# EAGLE design CNCPlotter (EAGLE 6.3)
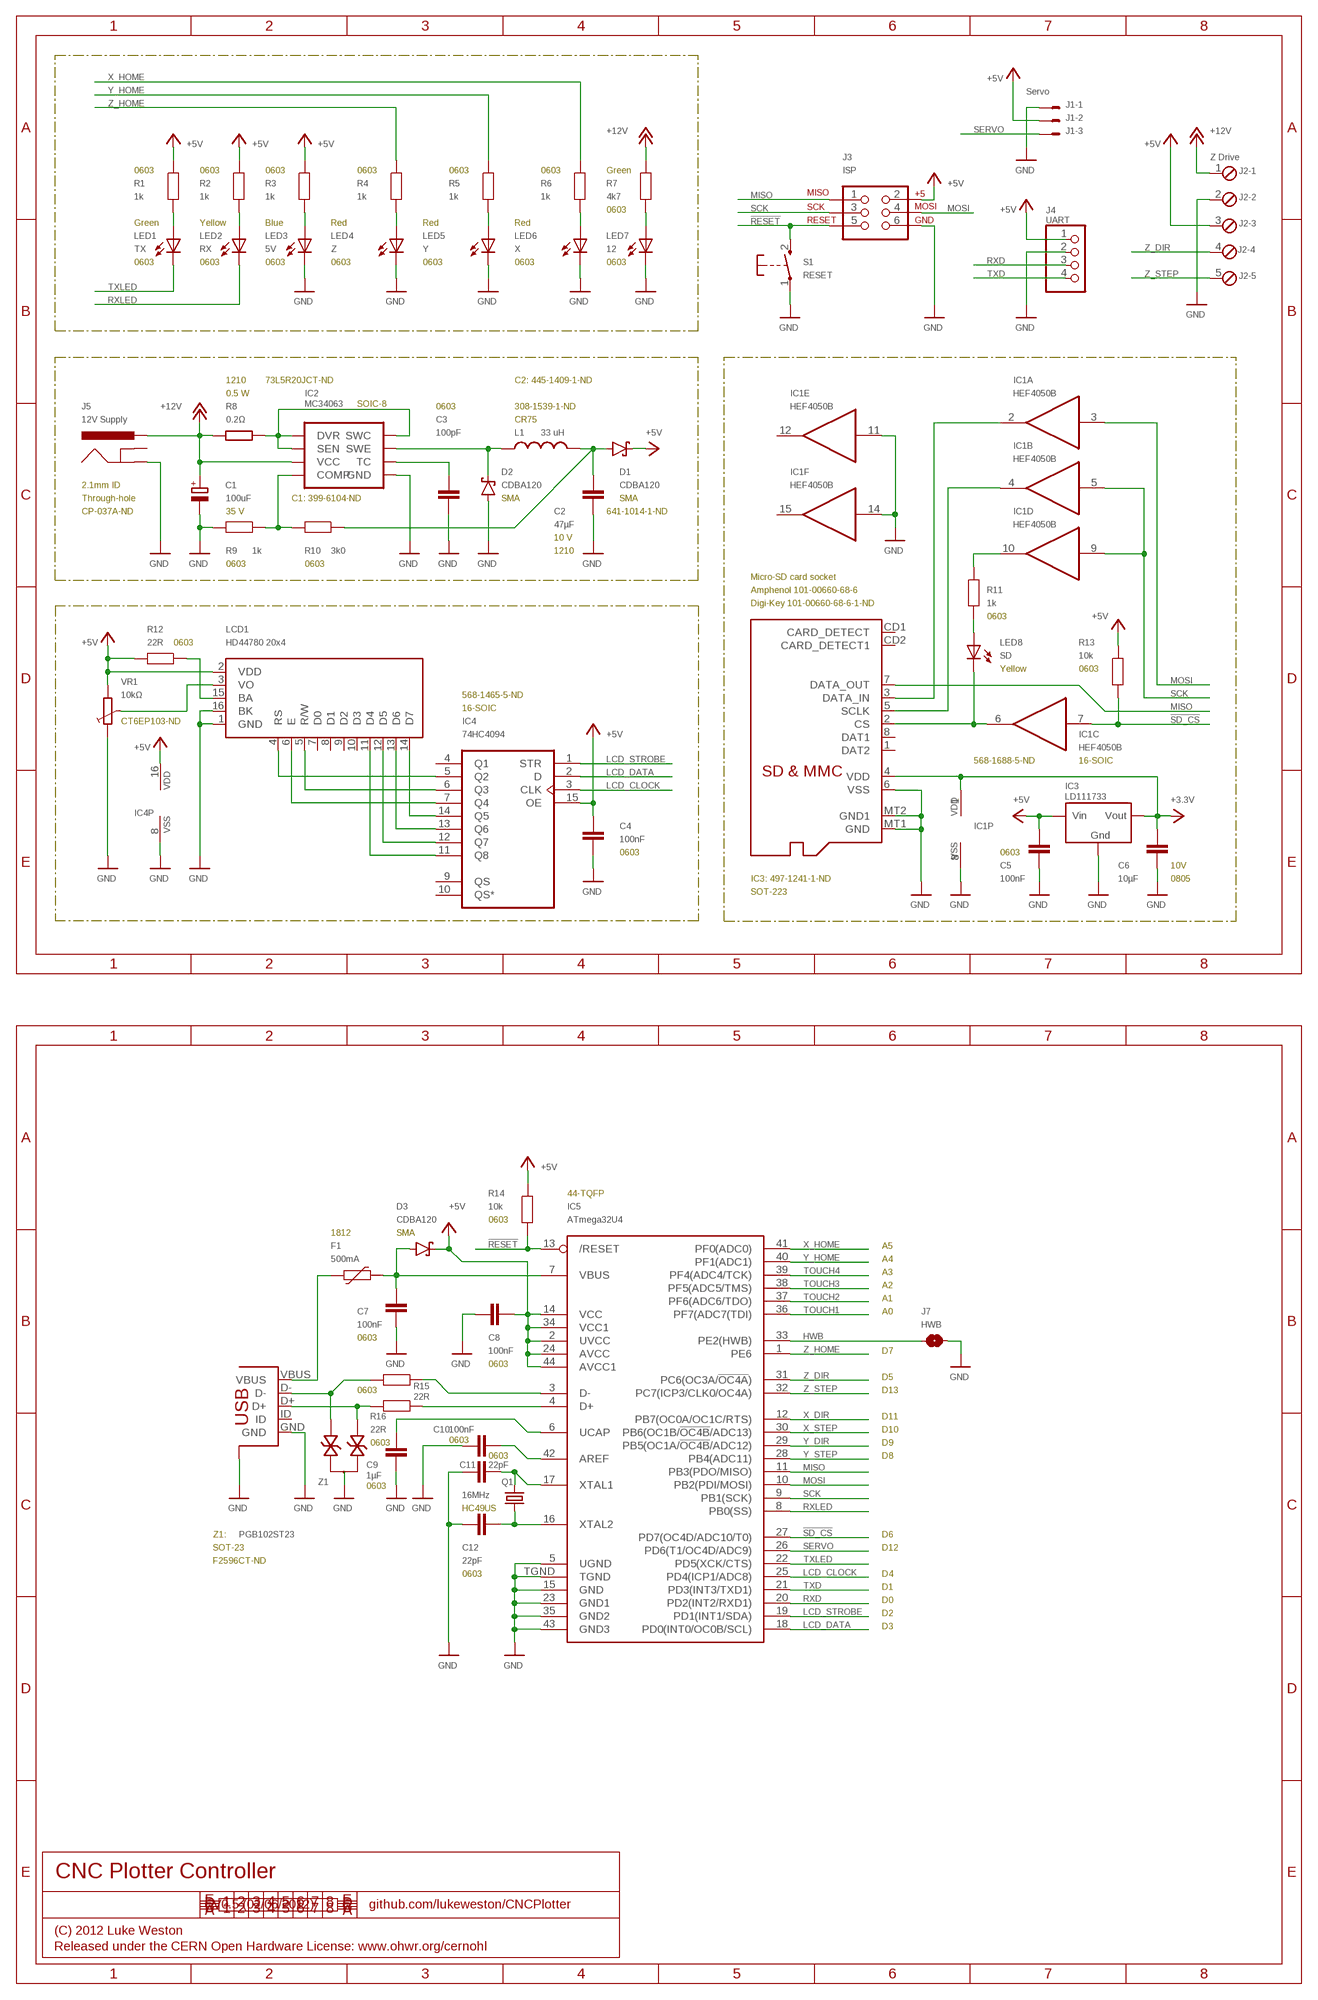
[diagram p0: schematic, sheet 1, part 1 of 2]
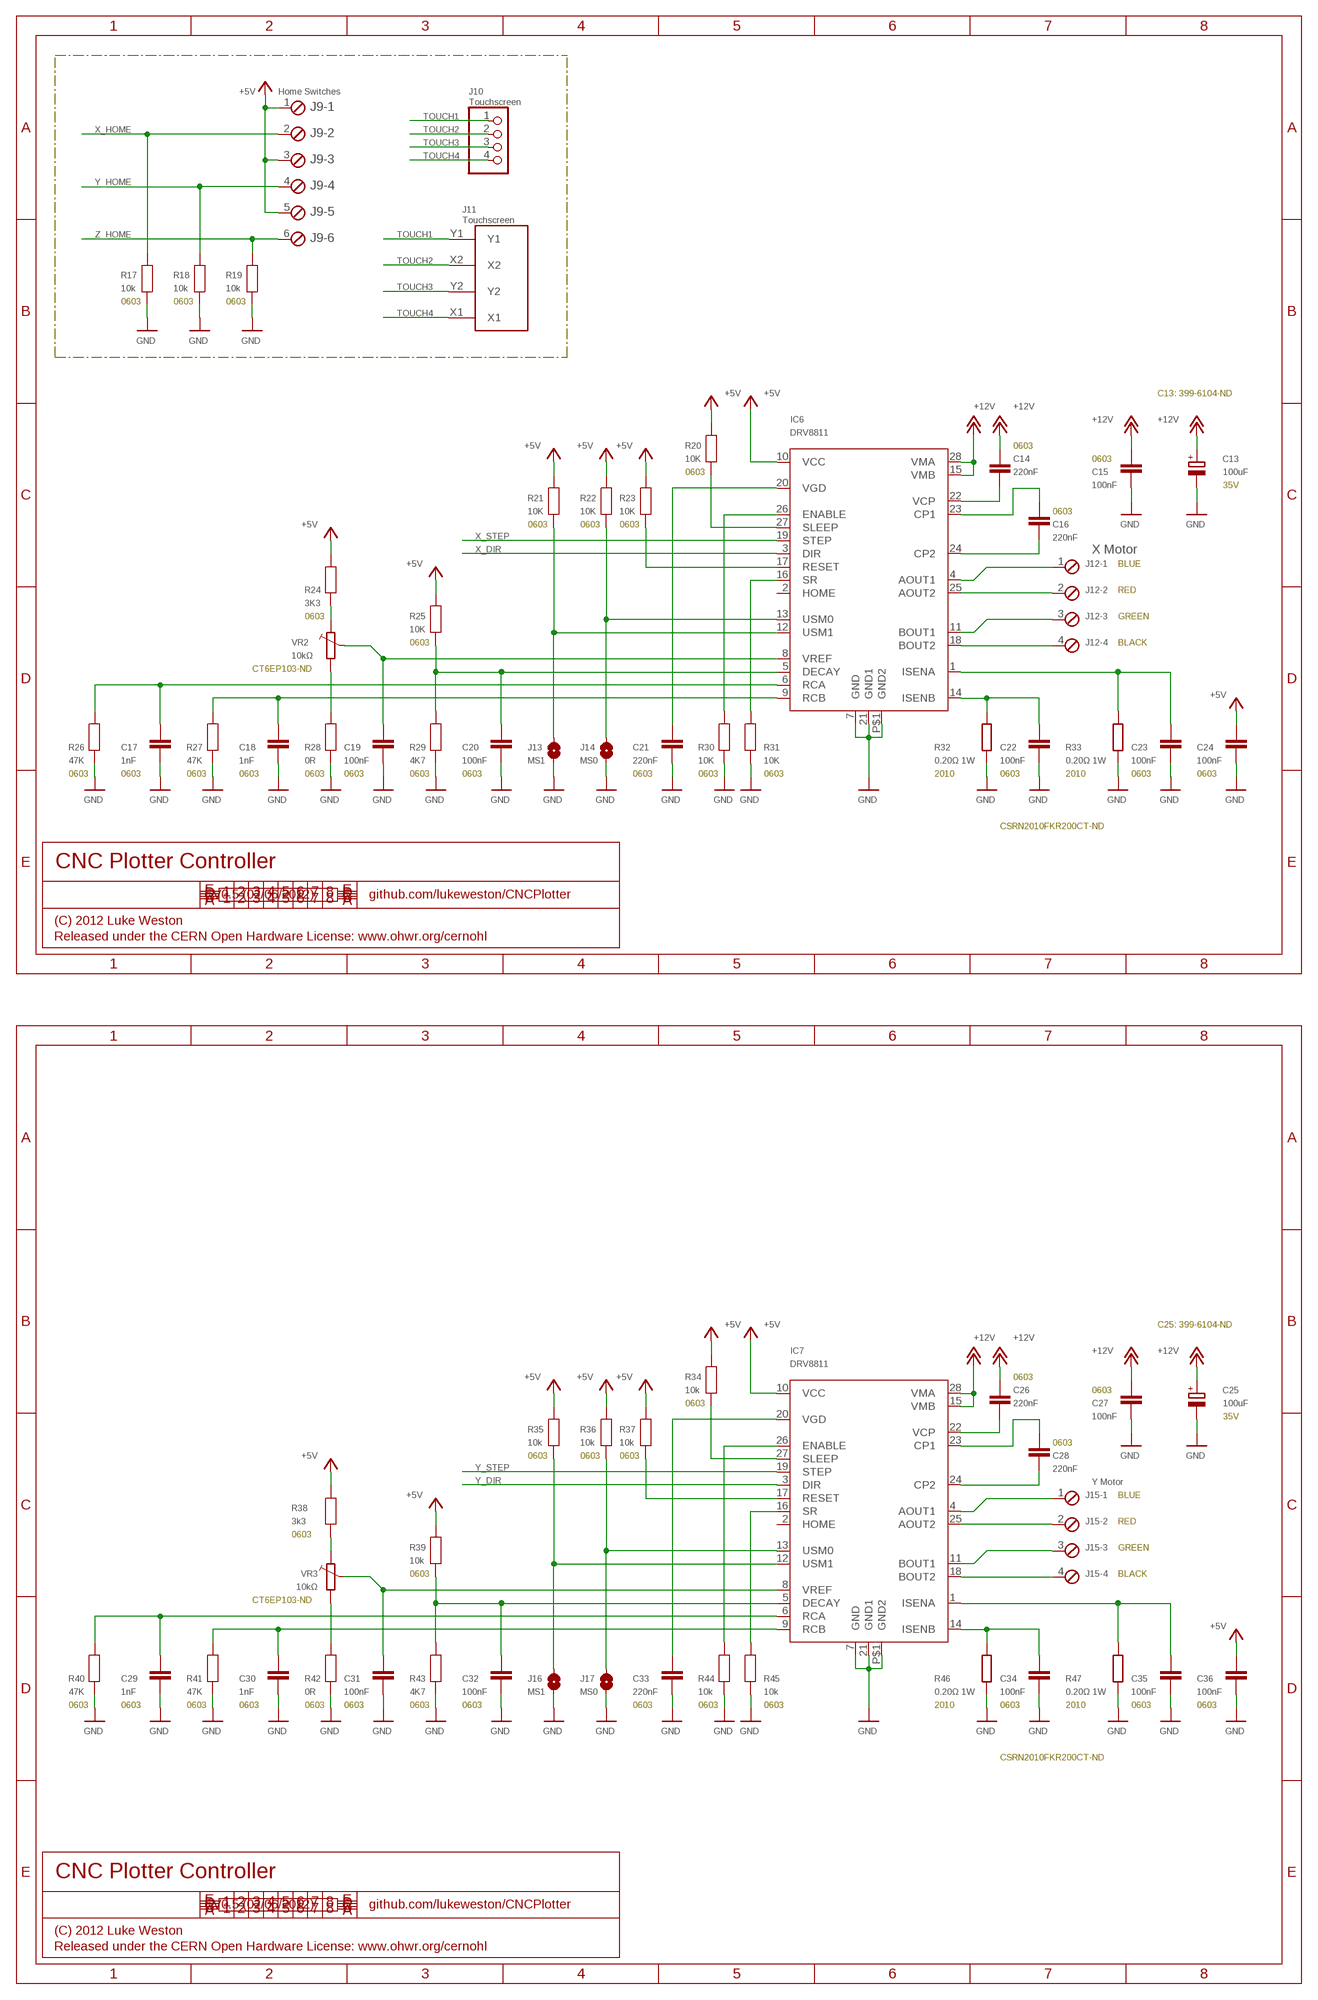
[diagram p1: schematic, sheet 1, part 2 of 2]

## Parts
C1  100uF  CPOL-EUE2.5-6  [E2,5-6]
C2  47µF  C-EUC1210  [C1210]
C3  100pF  CAP0603  [0603]
C4  100nF  CAP0603  [0603]
C5  100nF  CAP0603  [0603]
C6  10µF  CAP0805  [0805]
C7  100nF  CAP0603  [0603]
C8  100nF  CAP0603  [0603]
C9  1µF  CAP0603  [0603]
C10  100nF  CAP0603  [0603]
C11  22pF  CAP0603  [0603]
C12  22pF  CAP0603  [0603]
C13  100uF  CPOL-EUE2.5-6  [E2,5-6]
C14  220nF  CAP0603  [0603]
C15  100nF  CAP0603  [0603]
C16  220nF  CAP0603  [0603]
C17  1nF  CAP0603  [0603]
C18  1nF  CAP0603  [0603]
C19  100nF  CAP0603  [0603]
C20  100nF  CAP0603  [0603]
C21  220nF  CAP0603  [0603]
C22  100nF  CAP0603  [0603]
C23  100nF  CAP0603  [0603]
C24  100nF  CAP0603  [0603]
C25  100uF  CPOL-EUE2.5-6  [E2,5-6]
C26  220nF  CAP0603  [0603]
C27  100nF  CAP0603  [0603]
C28  220nF  CAP0603  [0603]
C29  1nF  CAP0603  [0603]
C30  1nF  CAP0603  [0603]
C31  100nF  CAP0603  [0603]
C32  100nF  CAP0603  [0603]
C33  220nF  CAP0603  [0603]
C34  100nF  CAP0603  [0603]
C35  100nF  CAP0603  [0603]
C36  100nF  CAP0603  [0603]
D1  CDBA120  SCHOTTKY  [SMA]
D2  CDBA120  SCHOTTKY  [SMA]
D3  CDBA120  SCHOTTKY  [SMA]
F1  500mA  PTC  [1812]
IC1  HEF4050B  4050D  [SO16]
IC2  MC34063  MC34063SMD  [SO08]
IC3  LD111733  REG1117  [SOT223]
IC4  74HC4094  4094D  [SO16@1]
IC5  ATmega32U4  ATMEGA32U4-QFN  [QFN-44N]
IC6  DRV8811  [HTSSOP28]
IC7  DRV8811  [HTSSOP28]
J1  Servo  22-23-2031  [22-23-2031]
J2  Z Drive  MPT5  [5POL254]
J3  ISP  AVR_SPI_PRG_6NS  [2X3-NS]
J4  UART  PINHD-1X4  [1X04]
J5  12V Supply  POWER_JACKSLT  [POWER_JACK_SLOT]
J6  MicroSD Card  ADAFRUIT_MICROSD  [ADAFRUIT_MICROSD]
J7  HWB  SJ  [SJ]
J8  USB  USB-FT  [USB-MINIB-FT]
J9  Home Switches  MPT6  [6POL254]
J10  Touchscreen  PINHD-1X4  [1X04]
J11  Touchscreen  DS_TOUCH_CONNECTOR  [DS_TOUCH_CONNECTOR]
J12  X Motor  MPT4  [4POL254]
J13  MS1  SJ  [SJ]
J14  MS0  SJ  [SJ]
J15  Y Motor  MPT4  [4POL254]
J16  MS1  SJ  [SJ]
J17  MS0  SJ  [SJ]
L1  33 uH  INDUCTORCR75  [CR75]
LCD1  HD44780 20x4  HDM20416L  [HDM20416L]
LED1  TX  LED0603  [LED-0603]
LED2  RX  LED0603  [LED-0603]
LED3  5V  LED0603  [LED-0603]
LED4  Z  LED0603  [LED-0603]
LED5  Y  LED0603  [LED-0603]
LED6  X  LED0603  [LED-0603]
LED7  12  LED0603  [LED-0603]
LED8  SD  LED0603  [LED-0603]
Q1  16MHz  CRYSTALHC49US  [HC49US]
R1  1k  RESISTOR0603  [0603]
R2  1k  RESISTOR0603  [0603]
R3  1k  RESISTOR0603  [0603]
R4  1k  RESISTOR0603  [0603]
R5  1k  RESISTOR0603  [0603]
R6  1k  RESISTOR0603  [0603]
R7  4k7  RESISTOR0603  [0603]
R8  0.2Ω  R-EU_R1210  [R1210]
R9  1k  RESISTOR0603  [0603]
R10  3k0  RESISTOR0603  [0603]
R11  1k  RESISTOR0603  [0603]
R12  22R  RESISTOR0603  [0603]
R13  10k  RESISTOR0603  [0603]
R14  10k  RESISTOR0603  [0603]
R15  22R  RESISTOR0603  [0603]
R16  22R  RESISTOR0603  [0603]
R17  10k  RESISTOR0603  [0603]
R18  10k  RESISTOR0603  [0603]
R19  10k  RESISTOR0603  [0603]
R20  10K  RESISTOR0603  [0603]
R21  10K  RESISTOR0603  [0603]
R22  10K  RESISTOR0603  [0603]
R23  10K  RESISTOR0603  [0603]
R24  3K3  RESISTOR0603  [0603]
R25  10K  RESISTOR0603  [0603]
R26  47K  RESISTOR0603  [0603]
R27  47K  RESISTOR0603  [0603]
R28  0R  RESISTOR0603  [0603]
R29  4K7  RESISTOR0603  [0603]
R30  10K  RESISTOR0603  [0603]
R31  10K  RESISTOR0603  [0603]
R32  0.20Ω 1W  R-EU_R2010  [R2010]
R33  0.20Ω 1W  R-EU_R2010  [R2010]
R34  10k  RESISTOR0603  [0603]
R35  10k  RESISTOR0603  [0603]
R36  10k  RESISTOR0603  [0603]
R37  10k  RESISTOR0603  [0603]
R38  3k3  RESISTOR0603  [0603]
R39  10k  RESISTOR0603  [0603]
R40  47K  RESISTOR0603  [0603]
R41  47K  RESISTOR0603  [0603]
R42  0R  RESISTOR0603  [0603]
R43  4K7  RESISTOR0603  [0603]
R44  10k  RESISTOR0603  [0603]
R45  10k  RESISTOR0603  [0603]
R46  0.20Ω 1W  R-EU_R2010  [R2010]
R47  0.20Ω 1W  R-EU_R2010  [R2010]
S1  RESET  TAC_SWITCH_2PIN  [TACTILE_SWITCH_SMD_2PIN_TINY]
VR1  10kΩ  TRIM_EU-CT6  [CT6]
VR2  10kΩ  TRIM_EU-CT6  [CT6]
VR3  10kΩ  TRIM_EU-CT6  [CT6]
Z1  PGB102ST23  [SOT23-3]

## Nets
!RESET: IC5.13(/RESET) J3.5 R14.1 S1.2(S)
!SD_CS: IC1.7(C:I) IC5.27(PD7(OC4D/ADC10/T0)) R13.1
+5V: C4.1 C5.1 C8.2 C24.1 C36.1 D1.K D3.K IC3.3(VIN) IC4.15(OE) IC4.16(VDD) IC5.2(UVCC) IC5.14(VCC) IC5.24(AVCC) IC5.34(VCC1) IC5.44(AVCC1) IC6.10(VCC) IC7.10(VCC) J1.2 J2.3 J3.2 J4.1 J9.1 J9.3 J9.5 LCD1.2(VDD) R1.2 R2.2 R3.2 R12.2 R13.2 R14.2 R20.2 R21.2 R22.2 R23.2 R24.2 R25.2 R34.2 R35.2 R36.2 R37.2 R38.2 R39.2 VR1.A
+12V: C1.+ C13.+ C14.1 C15.1 C25.+ C26.1 C27.1 IC2.6(VCC) IC6.15(VMB) IC6.28(VMA) IC7.15(VMB) IC7.28(VMA) J2.1 J5.PWR R7.2 R8.1
FOO: IC1.6(C:O) J6.2(CS) LED8.C
GND: C1.- C2.2 C3.2 C4.2 C5.2 C6.2 C7.2 C8.1 C9.1 C10.1 C11.1 C12.1 C13.- C15.2 C17.2 C18.2 C19.2 C20.2 C21.2 C22.2 C23.2 C24.2 C25.- C27.2 C29.2 C30.2 C31.2 C32.2 C33.2 C34.2 C35.2 C36.2 D2.A IC1.8(P:VSS) IC1.11(E:I) IC1.14(F:I) IC2.4(GND) IC3.1(GND) IC4.8(VSS) IC5.5(UGND) IC5.15(GND) IC5.23(GND1) IC5.35(GND2) IC5.43(GND3) IC5.TGND IC6.7(GND) IC6.21(GND1) IC6.P$1(GND2) IC7.7(GND) IC7.21(GND1) IC7.P$1(GND2) J1.1 J2.2 J3.6 J4.2 J5.GND J6.6(VSS) J6.MT1(GND) J6.MT2(GND1) J7.1 J8.GND J8.SH1(SH$1) J8.SH2(SH$1) J8.SH3(SH$1) J8.SH4(SH$1) J13.1 J14.1 J16.1 J17.1 LCD1.1(GND) LCD1.16(BK) LED3.C LED4.C LED5.C LED6.C LED7.C R9.2 R17.2 R18.2 R19.2 R26.1 R27.1 R28.1 R29.1 R30.1 R31.1 R32.1 R33.1 R40.1 R41.1 R42.1 R43.1 R44.1 R45.1 R46.1 R47.1 S1.1(P) VR1.E Z1.3
HWB: IC5.33(PE2(HWB)) J7.2
LCD_CLOCK: IC4.3(CLK) IC5.25(PD4(ICP1/ADC8))
LCD_DATA: IC4.2(D) IC5.18(PD0(INT0/OC0B/SCL))
LCD_STROBE: IC4.1(STR) IC5.19(PD1(INT1/SDA))
MISO: IC5.11(PB3(PDO/MISO)) J3.1 J6.7(DATA_OUT)
MOSI: IC1.3(A:I) IC5.10(PB2(PDI/MOSI)) J3.4
MOSI_3.3V: IC1.2(A:O) J6.3(DATA_IN)
N$1: IC7.4(AOUT1) J15.1
N$2: F1.1 J8.VBUS
N$3: IC6.4(AOUT1) J12.1
N$4: IC7.18(BOUT2) J15.4
N$5: IC7.11(BOUT1) J15.3
N$6: IC7.25(AOUT2) J15.2
N$7: C28.2 IC7.24(CP2)
N$8: C28.1 IC7.23(CP1)
N$9: C26.2 IC7.22(VCP)
N$10: C33.1 IC7.20(VGD)
N$11: C10.2 IC5.42(AREF)
N$12: LED4.A R4.1
N$13: C35.1 IC7.1(ISENA) R47.2
N$14: C34.1 IC7.14(ISENB) R46.2
N$15: C32.1 IC7.5(DECAY) R39.1 R43.2
N$16: C29.1 IC7.6(RCA) R40.2
N$17: C16.2 IC6.24(CP2)
N$18: C16.1 IC6.23(CP1)
N$19: IC6.16(SR) R31.2
N$20: C30.1 IC7.9(RCB) R41.2
N$21: IC6.18(BOUT2) J12.4
N$22: IC6.11(BOUT1) J12.3
N$23: IC6.25(AOUT2) J12.2
N$24: C14.2 IC6.22(VCP)
N$25: C20.1 IC6.5(DECAY) R25.1 R29.2
N$26: C21.1 IC6.20(VGD)
N$27: C17.1 IC6.6(RCA) R26.2
N$28: C9.2 IC5.6(UCAP)
N$29: LED3.A R3.1
N$30: LED2.A R2.1
N$31: LED1.A R1.1
N$32: IC2.1(SWC) IC2.7(SEN) IC2.8(DVR) R8.2
N$33: J8.D+ R16.2 Z1.1
N$34: J8.D- R15.2 Z1.2
N$35: C11.2 IC5.17(XTAL1) Q1.2
N$36: C12.2 IC5.16(XTAL2) Q1.1
N$37: IC5.4(D+) R16.1
N$38: IC5.3(D-) R15.1
N$39: LED5.A R5.1
N$40: C7.1 D3.A F1.2 IC5.7(VBUS)
N$41: LED6.A R6.1
N$42: LED7.A R7.1
N$43: C3.1 IC2.3(TC)
N$44: IC2.5(COMP) R9.1 R10.2
N$45: D2.K IC2.2(SWE) L1.P$1
N$46: C23.1 IC6.1(ISENA) R33.2
N$47: C22.1 IC6.14(ISENB) R32.2
N$48: C18.1 IC6.9(RCB) R27.2
N$49: IC6.27(SLEEP) R20.1
N$50: IC4.5(Q2) LCD1.4(RS)
N$51: IC4.6(Q3) LCD1.5(R/W)
N$52: IC4.7(Q4) LCD1.6(E)
N$53: IC4.11(Q8) LCD1.11(D4)
N$54: IC4.12(Q7) LCD1.12(D5)
N$55: IC4.13(Q6) LCD1.13(D6)
N$56: IC4.14(Q5) LCD1.14(D7)
N$57: IC6.17(RESET) R23.1
N$58: LCD1.3(VO) VR1.S
N$59: LCD1.15(BA) R12.1
N$60: R24.1 VR2.E
N$61: R28.2 VR2.A
N$62: LED8.A R11.1
N$63: IC1.10(D:O) R11.2
N$64: C19.1 IC6.8(VREF) VR2.S
N$65: IC6.26(ENABLE) R30.2
N$66: IC6.12(USM1) J13.2 R21.1
N$67: IC6.13(USM0) J14.2 R22.1
N$68: IC7.27(SLEEP) R34.1
N$69: IC7.17(RESET) R37.1
N$70: R38.1 VR3.E
N$71: R42.2 VR3.A
N$72: C31.1 IC7.8(VREF) VR3.S
N$73: IC7.26(ENABLE) R44.2
N$74: IC7.12(USM1) J16.2 R35.1
N$75: IC7.13(USM0) J17.2 R36.1
N$76: IC7.16(SR) R45.2
REG_5V: C2.1 D1.A L1.P$2 R10.1
RXD: IC5.20(PD2(INT2/RXD1)) J4.3
RXLED: IC5.8(PB0(SS)) LED2.C
SCK: IC1.5(B:I) IC1.9(D:I) IC5.9(PB1(SCK)) J3.3
SCK_3.3V: IC1.4(B:O) J6.5(SCLK)
SERVO: IC5.26(PD6(T1/OC4D/ADC9)) J1.3
TOUCH1: IC5.36(PF7(ADC7(TDI)) J10.1 J11.Y1
TOUCH2: IC5.37(PF6(ADC6/TDO)) J10.2 J11.X2
TOUCH3: IC5.38(PF5(ADC5/TMS)) J10.3 J11.Y2
TOUCH4: IC5.39(PF4(ADC4/TCK)) J10.4 J11.X1
TXD: IC5.21(PD3(INT3/TXD1)) J4.4
TXLED: IC5.22(PD5(XCK/CTS)) LED1.C
VDD: C6.1 IC1.1(P:VDD) IC3.2(VOUT) J6.4(VDD) ; supply symbol labelled +3.3V
X_DIR: IC5.12(PB7(OC0A/OC1C/RTS)) IC6.3(DIR)
X_HOME: IC5.41(PF0(ADC0)) J9.2 R6.2 R17.1
X_STEP: IC5.30(PB6(OC1B/!OC4B!/ADC13)) IC6.19(STEP)
Y_DIR: IC5.29(PB5(OC1A/!OC4B!/ADC12)) IC7.3(DIR)
Y_HOME: IC5.40(PF1(ADC1)) J9.4 R5.2 R18.1
Y_STEP: IC5.28(PB4(ADC11)) IC7.19(STEP)
Z_DIR: IC5.31(PC6(OC3A/!OC4A!)) J2.4
Z_HOME: IC5.1(PE6) J9.6 R4.2 R19.1
Z_STEP: IC5.32(PC7(ICP3/CLK0/OC4A)) J2.5
Unconnected: IC1.12(E:O) IC1.15(F:O) IC4.4(Q1) IC4.9(QS) IC4.10(QS*) IC6.2(HOME) IC7.2(HOME) J5.SW(GNDBREAK) J6.1(DAT2) J6.8(DAT1) J6.CD1(CARD_DETECT) J6.CD2(CARD_DETECT1) J8.ID LCD1.7(D0) LCD1.8(D1) LCD1.9(D2) LCD1.10(D3)

## Notes on the sheet
- 0603 | 0603 | 0603 | 0603 | 0603 | 0603 | Green
- 0603
- Green | Yellow | Blue | Red | Red | Red
- 0603 | 0603 | 0603 | 0603 | 0603 | 0603 | 0603
- 1210 | 73L5R20JCT-ND | C2: 445-1409-1-ND
- 0.5 W
- SOIC-8 | 0603 | 308-1539-1-ND
- CR75
- 2.1mm ID
- Through-hole | C1: 399-6104-ND | SMA | SMA
- CP-037A-ND | 35 V | 641-1014-1-ND
- 10 V
- 1210
- 0603 | 0603
- Micro-SD card socket
- Amphenol 101-00660-68-6
- Digi-Key 101-00660-68-6-1-ND
- 0603
- 0603
- Yellow | 0603
- 568-1465-5-ND
- 16-SOIC
- CT6EP103-ND
- 568-1688-5-ND | 16-SOIC
- 0603 | 0603
- 10V
- IC3: 497-1241-1-ND | 0805
- SOT-223
- 44-TQFP
- 0603
- 1812 | SMA
- A5
- A4
- A3
- A2
- A1
- A0
- 0603
- D7
- 0603
- D5
- 0603 | D13
- D11
- D10
- 0603 | 0603 | D9
- 0603 | D8
- 0603
- HC49US
- Z1: | D6
- SOT-23 | D12
- F2596CT-ND
- 0603 | D4
- D1
- D0
- D2
- D3
- CNC Plotter Controller
- V0.5 (02/06/2012) | github.com/lukeweston/CNCPlotter
- (C) 2012 Luke Weston
- Released under the CERN Open Hardware License: www.ohwr.org/cernohl
- 0603 | 0603 | 0603
- C13: 399-6104-ND
- 0603
- 0603
- 0603
- 35V
- 0603
- 0603 | 0603 | 0603
- BLUE
- RED
- 0603 | GREEN
- 0603 | BLACK
- CT6EP103-ND
- 0603 | 0603 | 0603 | 0603 | 0603 | 0603 | 0603 | 0603 | 0603 | 0603 | 0603 | 2010 | 0603 | 2010 | 0603 | 0603
- CSRN2010FKR200CT-ND
- CNC Plotter Controller
- V0.5 (02/06/2012) | github.com/lukeweston/CNCPlotter
- (C) 2012 Luke Weston
- Released under the CERN Open Hardware License: www.ohwr.org/cernohl
- C25: 399-6104-ND
- 0603
- 0603
- 0603
- 35V
- 0603
- 0603 | 0603 | 0603
- BLUE
- RED
- 0603
- GREEN
- 0603 | BLACK
- CT6EP103-ND
- 0603 | 0603 | 0603 | 0603 | 0603 | 0603 | 0603 | 0603 | 0603 | 0603 | 0603 | 2010 | 0603 | 2010 | 0603 | 0603
- CSRN2010FKR200CT-ND
- CNC Plotter Controller
- V0.5 (02/06/2012) | github.com/lukeweston/CNCPlotter
- (C) 2012 Luke Weston
- Released under the CERN Open Hardware License: www.ohwr.org/cernohl

## Library data of the parts
C1 C13 C25 = rcl:CPOL-EU: POLARIZED CAPACITOR, European symbol
C2 = rcl:C-EU: CAPACITOR, European symbol
C3-C12 C14-C24 C26-C36 = freetronics-master-v1:CAP: Capacitor Standard 0603 ceramic capacitor, and 0.1" leaded capacitor.
D1-D3 = freetronics-luke:SCHOTTKY
F1 = freetronics-luke:PTC: Polymeric PTC ("Polyfuse")
IC1 = 40xx:4050: Hex non-inverting BUFFER
IC2 = SparkFun:MC34063
IC3 = burr-brown:REG1117: 800mA and 1A Low Dropout (LDO) Positive Regulator 1.8V, 2.5V, 2.85V, 3.3V, 5V, and Adj; MPN: REG1117; OC_FARNELL: 1097566; OC_NEWARK: 14P6981
IC4 = 40xx:4094: 8-stage SHIFT/STORE REGISTER, tri-state
IC5 = freetronics-jon:ATMEGA32U4: ATMEGA32U4
IC6 IC7 = eje-components:DRV8811
J1 = con-molex:22-23-2031: .100" (2.54mm) Center Header - 3 Pin; MF: MOLEX; MPN: 22-23-2031; OC_FARNELL: 1462950; OC_NEWARK: 30C0862
J2 = con-phoenix-254:MPT5: PHOENIX CONNECTOR; OC_FARNELL: unknown; OC_NEWARK: unknown
J3 = SparkFun:AVR_SPI_PRG_6: AVR ISP 6 Pin This is the reduced ISP connector for AVR programming. Common on Arduino. This footprint will take up less PCB space and can be used with a 10-pin to 6-pin adapter such as SKU: BOB-08508
J4 J10 = pinhead:PINHD-1X4: PIN HEADER
J5 = SparkFun:POWER_JACK: Power Jack This is the standard 5.5mm barrel jack for power. The PTH is the most common, proven, reliable, footprint. All others are experimental. The Slot footprint only works if the mill layer is transmitted to the PCB fab house so be warned. Spark Fun Electronics SKU : PRT-00119. Mating wall wart : TOL-00298 (and others)
J6 = RAMPSdisplay:ADAFRUIT_MICROSD: Micro-SD / Transflash card holder with SPI pinout For the 3M # 2908-05WB-MG and/or 4UCON #19656 push-push type
J7 J13 J14 J16 J17 = freetronics-luke:SJ: PCB "solder jumper". Note that there should nothing on the BOM corresponding to this "component".
J8 = freetronics-luke:USB-FT: 5-pin SMD USB mini-B. Same as Freetronics. (Turned off schematic pin labels on shield pins.)
J9 = con-phoenix-254:MPT6: PHOENIX CONNECTOR; OC_FARNELL: unknown; OC_NEWARK: unknown
J11 = SparkFun:DS_TOUCH_CONNECTOR: 4-pin DS touch screen connector
J12 J15 = con-phoenix-254:MPT4: PHOENIX CONNECTOR; OC_FARNELL: unknown; OC_NEWARK: unknown
L1 = SparkFun:INDUCTOR: Inductors Basic Inductor/Choke - 0603 and 1206. Footprints are not proven and vary greatly between part numbers.
LCD1 = abi-lcd:HDM20416L
LED1-LED8 = freetronics-master-v1:LED: LEDs Standard schematic elements and footprints for 5mm, 3mm, 1206, and 0603 sized LEDs. 5mm - Spark Fun Electronics SKU : COM-00529 (and others)
Q1 = freetronics-master-v1:CRYSTAL: Crystals Various standard crystals. Proven footprints. Spark Fun Electronics SKU : COM-00534
R1-R7 R9-R31 R34-R45 = freetronics-master-v1:RESISTOR: Resistor Basic schematic elements and footprints for 0603, 1206, and PTH 1/10th watt (small) resistors.
R8 R32 R33 R46 R47 = rcl:R-EU_: RESISTOR, European symbol
S1 = freetronics-master-v1:TAC_SWITCH_2PIN: Momentary Tactile Switch - 2 pin
VR1-VR3 = pot:TRIM_EU-: POTENTIOMETER
Z1 = freetronics-luke:PGB102ST23: Littelfuse PGB1 ESD transient suppressor in dual SOT-23 package. http://www.littelfuse.com/data/en/Data_Sheets/Littelfuse_PulseGuard-ESD_PGB1.pdf

## Board
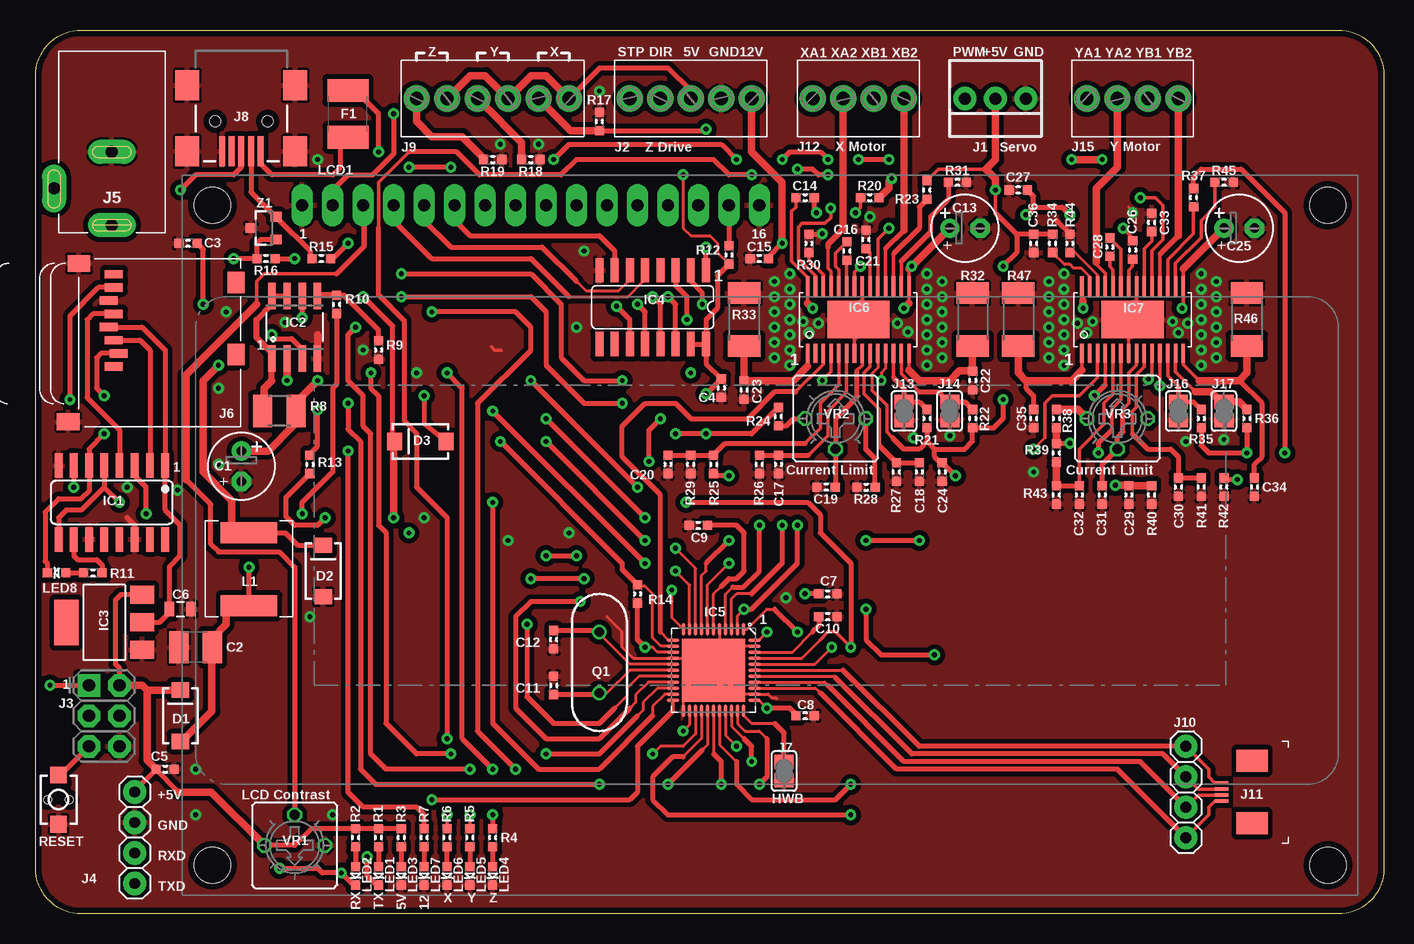
[diagram p2: board, top side]
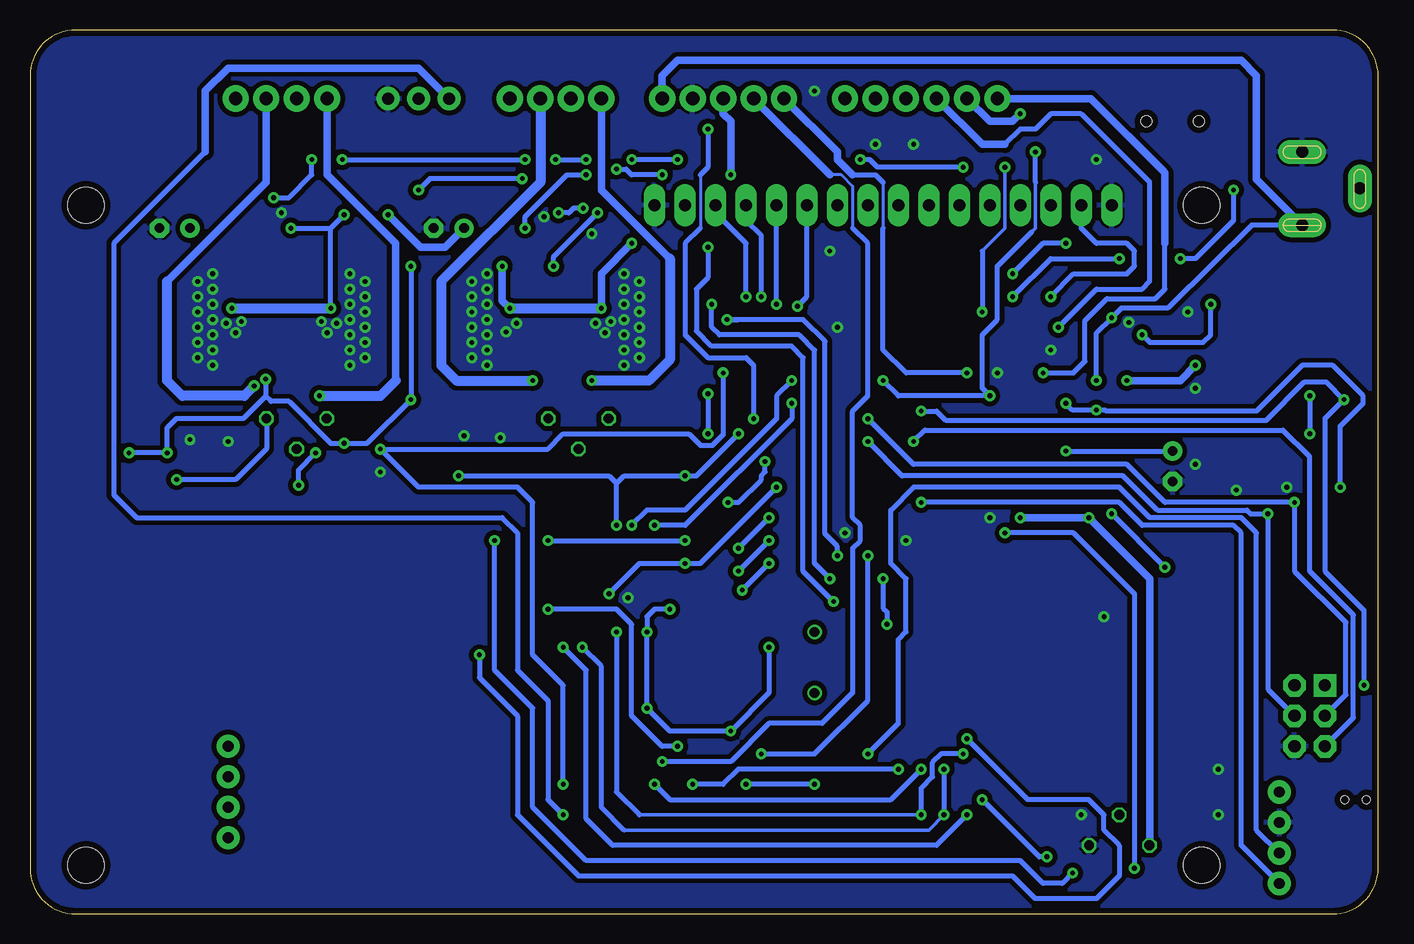
[diagram p3: board, bottom side, seen from below]

Size 112.39 x 73.66 mm. Coordinates in mm from the lower left corner, seen from the top.
Outline: 0,69.85 arc-90 3.81,73.66 108.58,73.66 arc-90 112.39,69.85 112.39,3.81 arc-90 108.58,0 3.81,0 arc-90 0,3.81 0,69.85
Copper layers (1*16): Top 0.035mm / dielectric 1.5mm / Bottom 0.035mm
Design rules "default": minimum track width 8mil, minimum drill 0.4mm, track to track 8mil, track to pad 8mil, pad to pad 8mil, via to via 8mil, smd to smd 8mil, copper to edge 20mil, drill to drill 8mil, minimum pad ring 8mil, minimum via ring 10mil, stop-mask expansion 3mil, vias tented up to drill 25mil, thermal gap 8mil

### Footprints (pad centres in the part's own frame; a part is rotated, then mirrored left to right if it is on the bottom)
E2,5-6 = drill 0.813 pad 1.6: + -1.27,0 | drill 0.813 pad 1.6 octagon: - 1.27,0
C1210 = smd 1.6 x 2.7: 1 -1.4,0; 2 1.4,0
0603 = smd 0.762 x 0.762: 1 -0.762,0; 2 0.762,0
0805 = smd 0.8 x 1.2: 1 -0.9,0; 2 0.9,0
SMA = smd 1.27 x 1.47: A -2.15,0; K 2.15,0
1812 = smd 1.9 x 3.4: 1 -1.95,0; 2 1.95,0
SO16 = smd 0.66 x 2.032: 1 -4.445,-3.073; 2 -3.175,-3.073; 3 -1.905,-3.073; 4 -0.635,-3.073; 5 0.635,-3.073; 6 1.905,-3.073; 7 3.175,-3.073; 8 4.445,-3.073; 9 4.445,3.073; 10 3.175,3.073; 11 1.905,3.073; 12 0.635,3.073; 13 -0.635,3.073; 14 -1.905,3.073; 15 -3.175,3.073; 16 -4.445,3.073
SO08 = smd 0.61 x 2.21: 1 -1.905,-2.616; 2 -0.635,-2.616; 3 0.635,-2.616; 4 1.905,-2.616; 5 1.905,2.616; 6 0.635,2.616; 7 -0.635,2.616; 8 -1.905,2.616
SOT223 = smd 1.499 x 2.007: 1 -2.261,-3.15; 2 0.025,-3.15; 3 2.311,-3.15 | smd 3.81 x 2.007: 4 0,3.15
SO16@1 = smd 0.66 x 2.032: 1 -4.445,-3.073; 2 -3.175,-3.073; 3 -1.905,-3.073; 4 -0.635,-3.073; 5 0.635,-3.073; 6 1.905,-3.073; 7 3.175,-3.073; 8 4.445,-3.073; 9 4.445,3.073; 10 3.175,3.073; 11 1.905,3.073; 12 0.635,3.073; 13 -0.635,3.073; 14 -1.905,3.073; 15 -3.175,3.073; 16 -4.445,3.073
QFN-44N = smd 0.3 x 1.05: 1 -2.5,-3.4; 2 -2,-3.4; 3 -1.5,-3.4; 4 -1,-3.4; 5 -0.5,-3.4; 6 0,-3.4; 7 0.5,-3.4; 8 1,-3.4; 9 1.5,-3.4; 10 2,-3.4; 11 2.5,-3.4; 23 2.5,3.4; 24 2,3.4; 25 1.5,3.4; 26 1,3.4; 27 0.5,3.4; 28 0,3.4; 29 -0.5,3.4; 30 -1,3.4; 31 -1.5,3.4; 32 -2,3.4; 33 -2.5,3.4 | smd 1.05 x 0.3: 12 3.4,-2.5; 13 3.4,-2; 14 3.4,-1.5; 15 3.4,-1; 16 3.4,-0.5; 17 3.4,0; 18 3.4,0.5; 19 3.4,1; 20 3.4,1.5; 21 3.4,2; 22 3.4,2.5; 34 -3.4,2.5; 35 -3.4,2; 36 -3.4,1.5; 37 -3.4,1; 38 -3.4,0.5; 39 -3.4,0; 40 -3.4,-0.5; 41 -3.4,-1; 42 -3.4,-1.5; 43 -3.4,-2; 44 -3.4,-2.5 | smd 5.25 x 5.25: TGND 0,0
HTSSOP28 = smd 0.3 x 1.6: 1 -4.225,-2.8; 2 -3.575,-2.8; 3 -2.925,-2.8; 4 -2.275,-2.8; 5 -1.625,-2.8; 6 -0.975,-2.8; 7 -0.325,-2.8; 8 0.325,-2.8; 9 0.975,-2.8; 10 1.625,-2.8; 11 2.275,-2.8; 12 2.925,-2.8; 13 3.575,-2.8; 14 4.225,-2.8; 15 4.225,2.8; 16 3.575,2.8; 17 2.925,2.8; 18 2.275,2.8; 19 1.625,2.8; 20 0.975,2.8; 21 0.325,2.8; 22 -0.325,2.8; 23 -0.975,2.8; 24 -1.625,2.8; 25 -2.275,2.8; 26 -2.925,2.8; 27 -3.575,2.8; 28 -4.225,2.8 | smd 5.18 x 3.1: P$1 0,0
22-23-2031 = drill 1 pad 1.93: 1 -2.54,0; 2 0,0; 3 2.54,0
5POL254 = drill 1.1 pad 2.184: 1 -5.08,0; 2 -2.54,0; 3 0,0; 4 2.54,0; 5 5.08,0
2X3-NS = drill 1.016 pad 1.88 square: 1 -2.54,-1.27 | drill 1.016 pad 1.88 octagon: 2 -2.54,1.27; 3 0,-1.27; 4 0,1.27; 5 2.54,-1.27; 6 2.54,1.27
1X04 = drill 0.9 pad 1.93: 1 -3.81,0; 2 -1.27,0; 3 1.27,0; 4 3.81,0
POWER_JACK_SLOT = drill 1 pad 2 long: GND 0,0; PWR 0,6.096; SW 4.826,3.048
ADAFRUIT_MICROSD = smd 0.7 x 1.5: 1 9,-10.64; 2 7.9,-10.24; 3 6.8,-10.64; 4 5.7,-11.04; 5 4.6,-10.64; 6 3.5,-11.04; 7 2.4,-10.64; 8 1.3,-10.64 | smd 1.8 x 1.4: CD1 2,-0.44; CD2 8,-0.44 | smd 1.4 x 1.9: MT1 0.4,-13.54; MT2 13.6,-14.44
SJ = smd 1.168 x 1.6: 1 -0.762,0; 2 0.762,0
USB-MINIB-FT = smd 2.5 x 0.5: D+ 3.77,0; D- 3.77,0.8; GND 3.77,-1.6; ID 3.77,-0.8; VBUS 3.77,1.6 | smd 2.5 x 2: SH1 -1.73,-4.5; SH2 -1.73,4.5; SH3 3.77,4.5; SH4 3.77,-4.5 | hole 0.9: 1.27,2.2; 1.27,-2.2
6POL254 = drill 1.1 pad 2.184: 1 -6.35,0; 2 -3.81,0; 3 -1.27,0; 4 1.27,0; 5 3.81,0; 6 6.35,0
DS_TOUCH_CONNECTOR = smd 1.85 x 2.6: P$5 -2.6,0.2; P$6 2.6,0.2 | smd 0.3 x 1.1: X1 0.75,2.75; X2 -0.25,2.75; Y1 -0.75,2.75; Y2 0.25,2.75
4POL254 = drill 1.1 pad 2.184: 1 -3.81,0; 2 -1.27,0; 3 1.27,0; 4 3.81,0
CR75 = smd 1.75 x 4.7: P$1 0,0; P$2 6.05,0
HDM20416L = drill 1.016 pad 1.778 long: 1 -38.105,27.947; 2 -35.565,27.947; 3 -33.025,27.947; 4 -30.485,27.947; 5 -27.945,27.947; 6 -25.405,27.947; 7 -22.865,27.947; 8 -20.325,27.947; 9 -17.785,27.947; 10 -15.245,27.947; 11 -12.705,27.947; 12 -10.165,27.947; 13 -7.625,27.947; 14 -5.085,27.947; 15 -2.545,27.947; 16 -0.005,27.947 | hole 3: -45.593,27.94; -45.593,-27.064; 47.409,-27.064; 47.396,27.94
LED-0603 = smd 0.762 x 0.762: A -0.762,0; C 0.762,0
HC49US = drill 0.813: 1 -2.54,0; 2 2.54,0
R1210 = smd 1.6 x 2.7: 1 -1.4,0; 2 1.4,0
R2010 = smd 1.8 x 2.7: 1 -2.2,0; 2 2.2,0
TACTILE_SWITCH_SMD_2PIN_TINY = smd 1.4 x 1.4: 1 -2.05,0; 2 2.05,0 | hole 0.65: 0,0.9; 0,-0.9
CT6 = drill 0.813 octagon: A 2.515,0; E -2.515,0; S 0,-2.54
SOT23-3 = smd 0.8 x 0.9: 1 -0.95,-1; 2 0.95,-1; 3 0,1.1

### Placement (x,y rotation side)
C1  17.14,37.31 270 top
C2  13.34,22.23 180 top
C3  12.7,55.88 180 top
C4  57.15,43.81 270 top
C5  10.79,12.06 0 top
C6  12.06,25.4 0 top
C7  66.04,26.67 0 top
C8  64.14,16.51 180 top
C9  55.24,32.38 0 top
C10  66.04,24.77 180 top
C11  43.18,19.05 270 top
C12  43.18,22.86 90 top
C13  77.47,57.15 0 top
C14  64.14,59.69 0 top
C15  60.33,54.61 180 top
C16  67.63,55.24 90 top
C17  61.91,37.47 270 top
C18  73.66,36.83 270 top
C19  65.88,35.56 180 top
C20  52.7,37.47 270 top
C21  69.22,56.2 90 top
C22  78.11,44.45 270 top
C23  59.05,43.66 270 top
C24  75.56,36.83 270 top
C25  100.33,57.15 0 top
C26  91.44,55.32 270 top
C27  81.92,60.33 180 top
C28  89.53,55.56 270 top
C29  91.12,34.92 270 top
C30  95.25,35.56 270 top
C31  88.9,34.92 270 top
C32  87,34.92 270 top
C33  93.03,57.63 90 top
C34  101.6,35.56 270 top
C35  83.19,41.27 270 top
C36  83.19,55.88 270 top
D1  12.06,16.51 90 top
D2  23.97,28.57 90 top
D3  32.07,39.37 180 top
F1  26.04,66.67 90 top
IC1  6.35,34.29 180 top
IC2  21.59,48.9 0 top
IC3  5.71,24.29 90 top
IC4  51.44,50.56 180 top
IC5  56.52,20.32 180 top
IC6  68.58,49.53 0 top
IC7  91.44,49.53 0 top
J1  80.01,67.94 180 top
J2  54.61,67.94 180 top
J3  5.71,16.51 270 top
J4  8.26,6.35 270 top
J5  6.35,63.5 180 top
J6  17.14,54.61 270 top
J7  62.39,11.91 90 top
J8  17.14,67.31 270 top
J9  38.1,67.94 180 top
J10  95.89,10.16 90 top
J11  101.6,10.16 90 top
J12  68.58,67.94 0 top
J13  72.39,41.91 90 top
J14  76.2,41.91 90 top
J15  91.44,67.94 0 top
J16  95.25,41.91 90 top
J17  99.06,41.91 90 top
L1  17.78,31.75 270 top
LCD1  60.33,31.11 0 top
LED1  28.57,3.17 270 top
LED2  26.67,3.17 270 top
LED3  30.48,3.17 270 top
LED4  38.1,3.17 270 top
LED5  36.2,3.17 270 top
LED6  34.29,3.17 270 top
LED7  32.38,3.17 270 top
LED8  1.75,28.42 180 top
Q1  46.99,20.95 270 top
R1  28.57,6.35 90 top
R2  26.67,6.35 90 top
R3  30.48,6.35 90 top
R4  38.1,6.35 90 top
R5  36.2,6.35 90 top
R6  34.29,6.35 90 top
R7  32.38,6.35 90 top
R8  20.32,41.91 180 top
R9  28.57,46.99 270 top
R10  25.08,50.8 90 top
R11  4.76,28.42 0 top
R12  57.78,54.93 270 top
R13  22.86,37.47 270 top
R14  50.16,26.67 270 top
R15  23.81,54.61 180 top
R16  19.21,54.61 180 top
R17  46.99,66.04 90 top
R18  41.27,62.87 0 top
R19  38.1,62.87 0 top
R20  69.53,59.69 0 top
R21  74.3,41.27 270 top
R22  78.11,41.27 270 top
R23  74.3,60.33 90 top
R24  61.91,41.43 90 top
R25  56.52,37.47 270 top
R26  60.33,37.47 90 top
R27  71.75,36.83 90 top
R28  69.22,35.56 0 top
R29  54.61,37.47 90 top
R30  64.45,55.88 270 top
R31  76.83,60.96 180 top
R32  78.11,49.53 270 top
R33  59.05,49.53 270 top
R34  84.77,55.88 90 top
R35  97.16,41.27 270 top
R36  100.97,41.27 270 top
R37  96.52,59.69 90 top
R38  85.09,41.27 270 top
R39  85.09,38.42 90 top
R40  93.03,34.92 90 top
R41  97.16,35.56 90 top
R42  99.06,35.56 90 top
R43  85.09,34.92 90 top
R44  86.2,55.88 270 top
R45  99.06,60.96 180 top
R46  100.97,49.53 270 top
R47  81.92,49.53 270 top
S1  1.91,9.53 90 top
VR1  21.59,5.71 180 top
VR2  66.67,41.27 0 top
VR3  90.17,41.27 0 top
Z1  19.05,57.15 90 top

### Tracks (layer width: path | path; a pad name or v marks a point on that pad's centre or on a via)
!RESET  (via drill 0.4)
  Top 0.254: IC5.13 52.13,22.32 51.44,23.02 51.44,26.67 50.8,27.3 50.29,27.3 R14.1
  Top 0.406: v38.73,39.37 48.9,29.21 48.9,28.7 R14.1 | S1.2 2.05,11.57 J3.5
  Bottom 0.406: J3.5 2.06,16.35 2.06,24.92 5.71,28.57 5.71,38.1 7.94,40.32 37.78,40.32 v38.73,39.37
!SD_CS  (via drill 0.4)
  Top 0.254: IC5.27 56.02,14.11 55.56,13.65 55.24,13.34
  Top 0.406: IC1.7 v3.17,35.56 | R13.1 22.86,38.34 23.5,38.97 v23.5,41.99 | v46.99,10.79 28.34,10.79 27.07,12.06 27.07,39.37 26.04,40.4 v26.04,42.55 | v52.7,10.79 55.56,13.65
  Bottom 0.406: v3.17,35.56 3.17,40.64 1.27,42.55 1.27,43.18 3.81,45.72 6.35,45.72 10.16,41.91 22.7,41.91 22.78,41.99 v23.5,41.99 25.48,41.99 v26.04,42.55 | v46.99,10.79 v52.7,10.79
+5V  (via drill 0.4)
  Top 0.203: 74.93,38.73 74.3,39.53
  Top 0.254: 85.06,39.21 R39.2 85.12,39.21 | IC6.10 70.2,45.52 69.69,45.01 69.69,43.66 | R20.2 70.33,59.69 | 57.78,54.13 R12.2 56.83,55.12 56.83,55.88 56.2,56.52 54.61,56.52 53.98,57.15 v53.98,61.59 | 29.77,39.62 D3.K | IC5.44 60.28,22.82 v60.96,23.5 | IC5.2 58.52,24.86 v59.05,25.4 | IC5.34 60.28,17.82 v60.96,17.14 | IC5.24 54.52,15.78 v53.98,15.24 | IC5.14 51.84,21.82 51.44,22.23 v50.8,22.23
  Top 0.279: 69.69,43.66 70.96,42.39 70.96,40.16 71.44,39.69 | IC7.10 93.06,44.89 v92.75,44.57
  Top 0.305: R23.2 74.3,61.12 75.25,62.07 79.22,62.07 | 80.01,58.42 v80.01,60.33
  Top 0.406: 80.01,58.42 81.79,56.64 81.79,56.52 | R34.2 C36.1 81.92,56.64 81.79,56.52 | R35.2 97.16,39.05 97.79,38.42 v100.97,38.42 R36.2 | v104.14,38.42 104.14,58.42 100.49,62.07 97.16,62.07 96.52,61.44 R37.2 | 81.79,56.52 81.79,55.12 v80.64,53.98 | 85.06,39.21 v86.2,39.21 | R22.2 79.88,40.51 80.64,41.27 v80.64,42.86 | R22.2 78.11,40.48 | R21.2 74.3,39.53 74.3,39.37 | 74.3,39.37 74.93,38.73 | 74.93,38.73 77.47,38.73 78.11,39.37 R22.2 | 74.3,39.37 73.66,38.73 72.39,38.73 71.44,39.69 | 74.93,38.73 74.93,38.1 75.44,37.59 C24.1 75.6,37.59 v76.68,36.51 | R24.2 61.88,42.2 59.69,40.01 v55.88,40.01 v53.34,40.01 | J9.1 46.99,70.48 52.7,70.48 54.61,68.58 J2.3 | 56.72,36.62 R25.2 56.71,36.51 v57.78,36.51 | IC4.15 IC4.16 | 57.78,54.13 56.83,53.18 56.83,50.48 55.88,49.53 IC4.16 | J3.2 6.99,20.48 6.67,20.8 6.67,26.19 7.07,26.6 IC3.3 | 29.69,39.37 29.84,39.53 29.77,39.62 29.77,48.97 v27.3,51.44 | LCD1.2 24.76,60.32 26.04,61.59 28.1,61.59 29.84,63.34 v29.84,66.67 | VR1.A 21.59,5.71 22.99,7.11 R2.2 R1.2 R3.2 | v24.13,33.02 23.5,32.38 21.59,32.38 20.88,33.1 20.88,34.72 R13.2 | v59.05,25.4 59.69,25.4 63.5,29.21 v63.5,32.38 | C8.2 63.37,16.64 62.87,17.14 v60.96,17.14 | IC4.16 55.88,45.85 C4.1 55.88,43.31 v55.88,43.34 | 11.94,10.16 C5.1 8.26,10.29 J4.1 | v50.8,22.23 50.16,22.86 R14.2
  Top 0.61: R38.2 R39.2 | J1.2 80.01,62.87 79.22,62.07 80.01,61.28 v80.01,60.33 | 70.33,59.69 71.12,60.48 71.12,61.04 v71.36,61.28 | D1.K 9.28,18.66 | 9.28,18.66 8.89,19.05 J3.2 | VR1.A 14.63,10.16 11.94,10.16 | D3.K 29.6,38.98 29.84,39.37 v29.84,33.02 | 9.28,18.66 9.28,12.82 C5.1 | J9.5 36.2,69.85 37.47,69.85 J9.3 41.27,69.85 42.55,69.85 J9.1
  Bottom 0.254: LCD1.2
  Bottom 0.406: v104.14,38.42 v100.97,38.42 R36.2 100.2,41.27 94.61,41.27 92.75,43.14 | v80.64,53.98 v80.64,42.86 84.3,39.21 v86.2,39.21 87.31,39.21 90.81,42.7 92.31,42.7 92.75,43.14 | v71.36,61.28 79.06,61.28 v80.01,60.33 | v55.88,43.34 v55.88,40.01 | v92.75,44.57 92.75,43.14 | LCD1.2 24.77,57.15 23.5,55.88 20.95,55.88 20.32,55.24 20.32,53.98 20.95,53.34 25.4,53.34 v27.3,51.44 | VR1.A 19.07,6.96 19.05,6.99 | v59.05,25.4 60.33,25.4 60.96,24.77 v60.96,23.5 v60.96,17.14 59.05,15.24 v53.98,15.24 50.8,18.41 v50.8,22.23 | v53.34,40.01 56.83,36.51 v57.78,36.51 62.87,36.51 63.5,35.88 | v63.5,32.38 63.5,35.88 | v76.68,36.51 64.14,36.51 63.5,35.88
  Bottom 0.61: 19.05,5.71 19.05,6.99 19.05,27.94 v24.13,33.02 v29.84,33.02 | v53.98,61.59 53.98,66.04 54.61,66.67 J2.3 | J9.5 32.38,66.04 30.48,66.04 v29.84,66.67
+12V  (via drill 0.4)
  Top 0.203: IC6.28 64.36,53.04
  Top 0.254: 87.22,51.22 87.31,51.12
  Top 0.279: 64.36,53.04 63.02,54.37 63.02,58.55 | C26.1 91.44,56.36 v90.65,57.15
  Top 0.305: 95.67,50.58 IC7.15 95.67,53.76 | IC7.28 87.22,51.22 | 72.81,50.9 IC6.15 72.81,53.76 | IC6.28 64.36,50.9 | C14.1 63.37,58.9 63.02,58.55
  Top 0.406: v82.55,58.26 83.19,58.9 | 83.19,58.9 85.57,58.9 v86.2,58.26 | C15.1 61.09,54.74 v62.23,55.88 | IC2.6 v22.23,49.69 | 83.19,58.9 83.19,59.82 C27.1 | R7.2 32.38,8.26 31.75,8.89 27.3,8.89 26.04,10.16 v26.04,38.58
  Top 0.61: 95.67,50.58 v95.57,50.48 | 95.67,53.76 C25.+ | 87.31,51.12 v87.31,50.48 | 72.81,50.9 v72.39,50.48 | C13.+ v73.03,53.98 72.81,53.76 | 64.36,50.9 v64.77,50.48 | v62.23,55.88 62.23,60.96 59.69,63.5 J2.1 | v23.5,44.45 22.07,43.02 22.23,42.86 22.23,42.55 21.72,42.04 R8.1 21.59,41.78 21.59,40.8 19.37,38.58 C1.+
  Bottom 0.406: v90.65,57.15 87.31,57.15 | v87.31,50.48 87.31,57.15 | v86.2,58.26 87.31,57.15 | v23.5,44.45 23.5,48.42 v22.23,49.69 21.43,50.48 17.54,50.48 17.38,50.64 10.54,57.4 J5.PWR | v26.04,38.58 C1.+
  Bottom 0.61: C13.+ 77.79,55.56 79.85,55.56 v82.55,58.26 | v73.03,53.98 73.03,51.12 v72.39,50.48 | v64.77,50.48 64.77,53.34 v62.23,55.88 | 6.35,57.47 J5.PWR 10.16,61.21 10.16,69.85 11.43,71.12 58.42,71.12 59.69,69.85 J2.1
  Bottom 0.813: v95.57,50.48 v87.31,50.48 | v72.39,50.48 v64.77,50.48
FOO  (via drill 0.4)
  Top 0.406: J6.2 5.43,46.71 5.08,46.35 5.08,43.81 v5.71,43.18 | LED8.C 0.98,29.18 0.79,29.37 0.79,33.5 1.91,34.61 3.81,34.61 4.45,35.24 IC1.6 4.45,38.73 v5.71,40.01
  Bottom 0.406: v5.71,43.18 v5.71,40.01
GND  (via drill 0.4)
  Top 0.254: R44.1 86.23,56.64 | IC7.7 91.11,48.57 91.44,48.9 | 91.6,58.42 91.12,58.9 | IC7.21 91.77,50.49 91.44,50.16 | 68.91,49.22 IC6.P$1 | 68.58,50.16 68.25,49.84 68.25,48.9 68.91,49.55 | IC5.5 57.02,22.36 57.15,22.23 58.42,22.23 58.52,22.32 IC5.43 | IC5.23 54.02,17.82 54.61,18.41 | 57.15,19.68 58.52,18.32 IC5.35 61.05,18.32 61.36,18.02 61.67,18.02 61.75,17.94 | 57.15,19.68 IC5.TGND 55.24,21.59 54.61,21.59 54.34,21.32 IC5.15 | 57.15,19.68 56.52,19.68 55.88,20.32 | IC5.15 49.8,21.32 48.9,22.23 48.9,23.5 47.62,24.77 | IC5.15 54.24,21.32 54.61,20.95
  Top 0.279: IC6.7 68.25,48.9 | IC6.21 68.91,49.55 | 37.99,47.26 38.26,46.99 38.81,46.99
  Top 0.406: 86.23,56.64 85.09,57.78 | IC1.14 8.26,32.38 7.62,33.02 | R30.1 65.45,56.64 v65.56,56.67 | 54.61,18.41 55.24,18.41 56.52,19.68 | 55.24,21.59 56.24,21.59 57.02,22.36
  Top 0.61: IC2.4 23.5,48.26
  other vias: 84.45,52.7 85.72,53.34 85.72,52.07 85.72,50.8 84.45,51.44 84.45,50.16 85.72,49.53 85.72,48.26 84.45,48.9 84.45,47.62 84.45,46.35 85.72,45.72 85.72,46.99 97.16,53.34 97.16,52.07 97.16,50.8 97.16,49.53 97.16,48.26 97.16,46.99 97.16,45.72 98.42,50.16 98.42,51.44 98.42,52.7 98.42,48.9 98.42,47.62 98.42,46.35 86.84,49.21 88.11,49.37 87.63,48.42 94.77,49.37 95.25,48.42 96.04,49.21 61.59,51.44 61.59,52.7 62.87,53.34 62.87,52.07 62.87,50.8 62.87,49.53 61.59,50.16 61.59,48.9 61.59,47.62 61.59,46.35 62.87,48.26 62.87,46.99 62.87,45.72 63.98,49.37 65.25,49.21 64.45,48.42 74.3,50.8 71.83,49.21 72.71,48.5 74.3,49.53 74.3,48.26 74.3,46.99 74.3,45.72 75.56,46.35 75.56,47.62 75.56,48.9 75.56,50.16 75.56,51.44 74.3,52.07 74.3,53.34 75.56,52.7 99.06,39.53 95.89,39.37 91.44,58.42 76.2,39.85 73.18,39.69 45.72,55.24 13.34,12.06 7.62,35.56 15.24,43.81 15.88,50.16 23.5,62.87 69.53,58.1 22.86,24.77 41.91,64.14 38.73,64.14 32.38,33.02 13.34,8.26 11.83,35.32 15.24,37.47 27.3,46.99 46.99,68.58 31.75,45.09 44.45,31.75 39.37,31.11 83.19,36.83 62.55,26.35 45.09,48.9 24.77,8.26 20.8,49.29
  pour Top (isolate 0.406): -1.27,73.66 114.3,73.66 114.3,-1.27 -1.27,-1.27
  pour Bottom (isolate 0.406): -1.27,73.66 114.3,73.66 114.3,-1.27 -1.27,-1.27
HWB
  Top 0.254: IC5.33 59.02,16.55 59.69,15.88 61.59,15.88 62.23,15.24
  Top 0.406: J7.2 62.39,15.08 61.59,15.88
LCD_CLOCK  (via drill 0.4)
  Top 0.254: IC5.25 55.02,15.01 53.98,13.97 52.07,13.97 v51.44,13.34
  Top 0.406: IC4.3 53.34,52.39 54.29,51.44 v54.29,49.53 | v42.55,29.84 v45.09,29.84
  Bottom 0.406: 53.34,49.53 v54.29,49.53 47.94,49.53 46.12,47.7 46.12,31.67 45.09,30.64 v45.09,29.84 | v51.44,13.34 46.99,13.34 42.55,17.78 v42.55,29.84
LCD_DATA  (via drill 0.4)
  Top 0.254: IC5.18 50.3,19.82 49.29,18.81 49.29,18.18 48.26,17.14
  Top 0.406: IC4.2 54.61,52.7 55.56,51.75 v55.56,50.8 | v45.72,27.94 v41.27,27.94 | v40.96,24.13 40.96,18.1 43.18,15.88 46.99,15.88 48.26,17.14
  Bottom 0.406: v55.56,50.8 55.56,48.9 54.93,48.26 48.26,48.26 46.99,46.99 46.99,29.21 v45.72,27.94 | v41.27,27.94 41.27,25.48 40.96,25.16 v40.96,24.13
LCD_STROBE  (via drill 0.4)
  Top 0.254: IC5.19 51.07,19.32 50.01,18.26 50.01,17.62 49.53,17.14
  Top 0.406: IC4.1 v55.88,55.56 | v45.4,26.04 41.27,26.04 40.01,24.77 40.01,17.14 42.55,14.61 46.99,14.61 49.53,17.14
  Bottom 0.406: v55.88,55.56 55.88,53.02 56.83,52.07 56.83,48.58 55.56,47.31 48.9,47.31 47.94,46.35 47.94,28.57 v45.4,26.04
MISO  (via drill 0.4)
  Top 0.254: v53.02,26.99 53.02,24.71 IC5.11
  Top 0.406: J6.7 5.22,52.21 2.86,49.85 v2.86,42.86 | v1.19,19.05 J3.1 | v50.8,29.21 v38.1,41.91
  Bottom 0.406: v1.19,19.05 1.19,25.32 4.45,28.57 4.45,41.27 v2.86,42.86 4.29,44.29 6.19,44.29 9.37,41.12 36.04,41.12 36.83,41.91 v38.1,41.91 | v50.8,29.21 v53.02,26.99
MOSI  (via drill 0.4)
  Top 0.254: IC5.10 54.52,27.4 v53.34,28.57
  Top 0.406: v9.21,33.34 9.21,35.56 8.26,36.51 IC1.3 | v50.8,31.11 v42.55,39.37
  Bottom 0.406: J3.4 9.21,18.73 v9.21,33.34 10.64,33.34 10.95,33.66 18.41,33.66 21.27,36.51 39.69,36.51 v42.55,39.37 | v53.34,28.57 v50.8,31.11
MOSI_3.3V
  Top 0.406: J6.3 8.71,47.81 9.53,46.99 IC1.2
N$1  (via drill 0.4)
  Top 0.279: IC7.4 89.17,44.08
  Top 0.406: 89.17,44.08 v88.27,43.18
  Bottom 0.61: 81.92,44.45 81.92,55.88 87.63,61.59 J15.1
  Bottom 0.813: v88.27,43.18 83.19,43.18 81.92,44.45
N$2
  Top 0.305: J8.VBUS 18.75,62.53 18.89,62.39 | 25.4,64.14 F1.1
  Top 0.406: 18.89,62.39 19.68,61.59 24.77,61.59 25.4,62.23 25.4,64.09 F1.1
  Top 0.61: 25.4,64.14 24.77,64.14
N$3  (via drill 0.4)
  Top 0.279: IC6.4 66.31,45.19 v65.56,44.45
  Bottom 0.61: J12.1 64.77,60.33 59.05,54.61
  Bottom 0.813: 59.05,54.61 59.05,46.2 60.8,44.45 v65.56,44.45
N$4
  Top 0.279: IC7.18 93.72,54.98
  Top 0.406: 95.25,56.52 93.72,54.98
  Top 0.61: 95.25,56.52 J15.4
N$5  (via drill 0.4)
  Top 0.279: IC7.11 v93.72,44
  Bottom 0.61: J15.3 92.71,60.96 100.97,52.7
  Bottom 0.813: v93.72,44 94.54,43.18 99.69,43.18 100.97,44.45 100.97,52.7
N$6
  Top 0.279: 88.42,54.29 88.42,54.13 89.17,53.39 IC7.25
  Top 0.61: J15.2 90.17,62.23 88.42,60.48 88.42,54.29
N$7
  Top 0.279: IC7.24 89.81,53.7 89.53,53.98 C28.2
N$8
  Top 0.279: IC7.23 90.47,55.4 C28.1
N$9
  Top 0.279: IC7.22 91.11,53.65 91.44,53.98 C26.2
N$10
  Top 0.279: IC7.20 92.42,55.43 93.03,56.04 C33.1
N$11
  Top 0.254: IC5.42 63.09,21.82 64.77,23.5
  Top 0.406: C10.2 65.28,24 64.77,23.5
N$12
  Top 0.406: R4.1 LED4.A
N$13
  Top 0.305: IC7.1 87.22,45.3
  Top 0.406: 82.55,44.45 82.55,43.81 83.19,43.18 C35.1
  Top 0.61: 87.22,45.3 86.36,44.45 82.55,44.45 81.92,45.09 R47.2
N$14
  Top 0.305: IC7.14 95.67,45.78 97,44.45
  Top 0.406: C34.1 101.6,37.47 102.23,38.1 102.23,42.55 100.33,44.45
  Top 0.61: R46.2 100.97,45.09 100.33,44.45 97,44.45
N$15
  Top 0.279: C32.1 87,38.73 89.06,40.8 89.06,42.55 89.81,43.3 IC7.5
  Top 0.406: R43.2 C32.1
  Top 0.61: R39.1 R43.2
N$16  (via drill 0.4)
  Top 0.279: IC7.6 90.47,42.84 89.69,42.07 89.69,40.32
  Top 0.406: 89.69,40.32 88.58,39.21 v88.58,38.42 | 90.77,35.72 C29.1
  Top 0.61: v90.01,35.72 90.77,35.72 | R40.2 C29.1
  Bottom 0.406: v90.01,35.72 90.01,36.99 v88.58,38.42
N$17
  Top 0.279: IC6.24 66.95,53.7 66.67,53.98 66.67,55.05 C16.2
N$18
  Top 0.279: IC6.23 67.61,54.46 C16.1
N$19
  Top 0.279: IC6.16 72.16,54.38
  Top 0.406: 72.16,54.38 74.61,56.83 74.61,58.1 76.07,59.56 R31.2
N$20
  Top 0.279: 91.44,40.01 91.44,41.91 91.76,42.23 91.76,44.93 92.42,45.58 IC7.9
  Top 0.406: 91.44,40.01 92.71,38.73 94.61,38.73 95.25,38.1 C30.1 R41.2
N$21
  Top 0.279: IC6.18 70.86,55.46
  Top 0.406: 70.86,55.46 72.39,56.99
  Top 0.61: 72.39,56.99 J12.4
N$22  (via drill 0.4)
  Top 0.254: IC6.11 70.86,45.45 70.48,45.09 v70.48,44.45
  Bottom 0.813: J12.3 69.85,60.96 78.11,52.7 78.11,45.72 76.83,44.45 v70.48,44.45
N$23
  Top 0.279: IC6.25 66.31,53.55 66.04,53.82 66.04,55.56
  Top 0.457: 66.04,55.56 66.04,55.8 67.31,57.07
  Top 0.61: J12.2 67.31,57.07
N$24  (via drill 0.4)
  Top 0.279: IC6.22 68.25,53.49 v68.74,53.98
  Top 0.406: C14.2 64.9,58.61 v65.09,58.42
  Bottom 0.406: v68.74,53.98 68.74,54.77 v65.09,58.42
N$25
  Top 0.203: R25.1 56.52,38.26
  Top 0.279: 64.14,39.21 65.41,40.48 65.41,42.55 66.95,44.09 IC6.5
  Top 0.406: 56.52,38.26 57.47,39.21 64.14,39.21 | C20.1 R29.2 R25.1
N$26
  Top 0.279: IC6.20 69.56,55.1 C21.1
N$27
  Top 0.279: IC6.6 67.61,43.48 66.04,41.91 66.04,39.85 64.42,38.23
  Top 0.406: 64.42,38.23 C17.1 R26.2
N$28
  Top 0.254: IC5.6 56.52,26.67 57.15,27.3
  Top 0.406: 57.15,27.3 57.78,27.94 58.42,27.94 59.05,28.57 59.05,31.75 58.42,32.38 C9.2
N$29
  Top 0.406: R3.1 LED3.A
N$30
  Top 0.406: R2.1 LED2.A
N$31
  Top 0.406: R1.1 LED1.A
N$32
  Top 0.406: IC2.8 IC2.7 | 19.05,42.04 R8.2 | 19.61,47.15 19.61,46.36 IC2.1
  Top 0.508: 19.68,44.45 IC2.1 19.68,46.75 18.41,48.02 18.41,49.53 19.68,50.8 IC2.8
  Top 0.61: 19.68,44.45 19.05,43.81 19.05,42.04
N$33  (via drill 0.4)
  Top 0.254: 18.26,54.77 R16.2 18.41,54.64
  Top 0.406: Z1.1 18.73,56.2 18.41,55.88 18.41,54.64 | J8.D+ 17.14,62.23 16.51,61.59 13.34,61.59 v12.06,60.33 | R16.2 v16.51,54.61
  Bottom 0.406: v12.06,60.33 12.06,57.78 15.24,54.61 v16.51,54.61
N$34
  Top 0.254: 20.05,58.05 Z1.2 20.16,58.1 20.16,57.94 | 22.86,54.8 R15.2
  Top 0.406: J8.D- 17.95,60.16 20.05,58.05 | 20.16,57.94 22.86,55.24 22.86,54.8
N$35
  Top 0.254: IC5.17 49.53,20.32 47.62,18.41 Q1.2
  Top 0.406: C11.2 46.86,18.29 Q1.2
N$36
  Top 0.254: IC5.16 49.53,20.82 46.99,23.36 Q1.1
  Top 0.406: C12.2 46.86,23.62 Q1.1
N$37  (via drill 0.4)
  Top 0.254: IC5.4 57.52,26.64 58.1,27.23
  Top 0.406: R16.1 v21.59,54.61 | v30.48,51.44 41.27,51.44 42.55,50.16 42.55,45.72 45.72,42.55 v48.9,42.55 | 58.1,27.23 58.98,27.23 60.33,28.57 v60.33,32.38
  Bottom 0.406: v21.59,54.61 27.3,54.61 v30.48,51.44 | v48.9,42.55 48.9,41.27 57.78,32.38 v60.33,32.38
N$38  (via drill 0.4)
  Top 0.254: R15.1 24.77,54.61 | IC5.3 58.02,26.27 58.42,26.67 59.69,26.67
  Top 0.406: 24.77,54.61 v26.04,55.88 | v30.48,53.34 41.27,53.34 43.81,50.8 43.81,46.35 45.72,44.45 v48.9,44.45 | v62.23,32.38 62.23,29.21 59.69,26.67
  Bottom 0.406: v26.04,55.88 27.94,55.88 v30.48,53.34 | v48.9,44.45 50.16,43.18 50.16,41.27 57.78,33.66 60.96,33.66 v62.23,32.38
N$39
  Top 0.406: R5.1 LED5.A
N$40  (via drill 0.4)
  Top 0.254: IC5.7 56.02,27.44 v57.78,29.21
  Top 0.406: F1.2 26.62,68.62 28.57,66.67 v28.57,63.5 | v32.38,43.18 32.38,40.88 D3.A | v50.16,35.56 v41.27,44.45 | C7.1 v64.14,26.67
  Bottom 0.305: 28.57,60.96 28.57,57.15 28.89,56.83 29.84,55.88
  Bottom 0.406: 28.57,60.96 v28.57,63.5 | v50.16,35.56 56.52,29.21 v57.78,29.21 61.59,29.21 v64.14,26.67 | 28.89,56.83 31.75,53.98 31.75,49.53 33.02,48.26 33.02,43.81 v32.38,43.18 40.01,43.18 v41.27,44.45
N$41
  Top 0.406: LED6.A R6.1
N$42
  Top 0.406: R7.1 LED7.A
N$43  (via drill 0.4)
  Top 0.406: IC2.3 22.3,46.99 21.35,47.94 20,47.94 v19.68,48.26 | v13.97,50.8 13.97,55.37 C3.1
  Bottom 0.406: v19.68,48.26 19.05,47.62 14.61,47.62 13.97,48.26 v13.97,50.8
N$44
  Top 0.406: R9.1 28.57,48.66 25.67,51.56 R10.2
  Top 0.508: R10.2 23.55,51.56 IC2.5
N$45  (via drill 0.4)
  Top 0.406: D2.K 21.83,30.73 20.8,31.75 19.68,31.75 19.05,31.11 18.18,31.11 L1.P$1
  Top 0.61: L1.P$1 16.35,31.75 16.35,34.45 13.97,36.83 13.97,44.45 v15.24,45.72 | IC2.2 v20.95,44.45
  Bottom 0.61: v15.24,45.72 16.51,44.45 v20.95,44.45
N$46
  Top 0.279: 59.05,44.45 C23.1
  Top 0.305: IC6.1 64.36,45.62
  Top 0.61: 64.36,45.62 63.18,44.45 59.05,44.45 R33.2
N$47
  Top 0.279: C22.1 78.11,45.24
  Top 0.305: IC6.14 72.81,45.3
  Top 0.61: 72.81,45.3 73.66,44.45 76.2,44.45 76.99,45.24 78.11,45.24 R32.2
N$48
  Top 0.279: 70.33,39.02 70.33,42.07 69.06,43.34 69.06,45.09 69.56,45.58 IC6.9
  Top 0.406: 70.33,39.02 R27.2 C18.1
N$49  (via drill 0.4)
  Top 0.279: IC6.27 65,53.18 63.58,54.61 63.58,57.23 63.9,57.55 65.33,57.55
  Top 0.305: R20.1 68.77,58.85 v68.34,58.42 | 65.33,57.55 65.8,57.55 66.28,58.02 v66.28,58.82
  Bottom 0.406: v66.28,58.82 67.07,58.82 67.47,58.42 v68.34,58.42
N$50
  Top 0.254: 44.45,51.44 49.37,51.44 50.64,52.7 50.64,53.48 IC4.5
  Top 0.406: 44.45,51.44 41.27,54.61 33.02,54.61 29.84,57.78 LCD1.4
N$51
  Top 0.254: IC4.6 49.53,52.86 48.58,51.91 45.88,51.91 45.09,52.7
  Top 0.406: LCD1.5 32.38,57.78 34.61,55.56 42.23,55.56 45.09,52.7
N$52
  Top 0.406: LCD1.6 34.92,57.79 36.2,56.52 46.99,56.52 48.26,55.24 IC4.7
N$53  (via drill 0.4)
  Top 0.406: IC4.11 49.53,49.53 v48.42,50.64
  Bottom 0.406: v48.42,50.64 47.62,51.44 47.62,57.78 47.62,57.79 LCD1.11
N$54  (via drill 0.4)
  Top 0.406: IC4.12 50.8,50.16 v50.16,50.8
  Bottom 0.406: v50.16,50.8 LCD1.12
N$55  (via drill 0.4)
  Top 0.406: IC4.13 52.07,50.8 v51.44,51.44
  Bottom 0.406: LCD1.13 52.7,57.78 51.44,56.52 v51.44,51.44
N$56  (via drill 0.4)
  Top 0.406: IC4.14 53.34,50.8 v52.7,51.44
  Bottom 0.406: v52.7,51.44 52.7,55.88 55.24,58.42 LCD1.14
N$57
  Top 0.279: IC6.17 71.5,54.99
  Top 0.406: R23.1 74.3,59.53 73.66,58.9 73.66,57.15 71.5,54.99
N$58
  Top 0.305: LCD1.3 27.3,55.56 25.08,53.34 19.05,53.34 18.41,52.7 18.41,50.8 16.51,48.9
  Top 0.406: 12.54,36.2 14.61,34.13 14.61,30.8 15.24,30.16 20.32,30.16 21.59,28.89 VR1.S | 27.38,59.05 27.38,55.64 25.08,53.34
  Top 0.61: 12.54,36.2 12.54,44.93 18.41,50.8
N$59
  Top 0.254: R12.1
  Top 0.406: LCD1.15 R12.1
N$60
  Top 0.406: R24.1 62.58,40.67 63.18,41.27 VR2.E
N$61
  Top 0.406: R28.2 69.98,37.97 69.19,38.76 VR2.A
N$62
  Top 0.406: LED8.A R11.1
N$63
  Top 0.406: IC1.10 3.17,29.84 3.49,29.53 5.08,29.53 5.56,29.05 5.56,28.45 R11.2
N$64
  Top 0.254: 66.67,40.64 VR2.S | 66.67,35.59 C19.1
  Top 0.279: IC6.8 68.91,45.73 68.42,45.24
  Top 0.406: 66.67,35.59 VR2.S 66.67,41.27 68.42,43.02 68.42,45.24
N$65
  Top 0.279: IC6.26 65.66,53.25 64.45,54.45 R30.2
N$66
  Top 0.279: IC6.12 71.5,44.7
  Top 0.406: R21.1 73.66,42.67 J13.2 72.39,43.81 71.5,44.7
N$67
  Top 0.279: IC6.13 72.16,45 73.66,43.5
  Top 0.406: 73.66,43.5 75.25,43.5 75.72,43.02 75.85,43.02 J14.2 77.47,42.67 R22.1
N$68
  Top 0.254: IC7.27 87.86,53.1 87.15,53.82 86.52,53.82 86.2,54.13 85.76,54.13 R34.1
N$69
  Top 0.279: IC7.17 94.36,54.52 96.52,56.67 R37.1
N$70
  Top 0.61: R38.1 86.89,42.04 VR3.E
N$71  (via drill 0.4)
  Top 0.254: 99.19,36.2 R42.2
  Top 0.406: v100.17,36.2 99.19,36.2
  Bottom 0.406: VR3.A 92.69,38.76 95.25,36.2 v100.17,36.2
N$72
  Top 0.279: 90.65,41.75 90.65,42.07 91.12,42.55 91.12,45.09 91.77,45.73 IC7.8
  Top 0.406: C31.1 88.9,37.47 VR3.S 90.17,39.69 90.65,40.16 90.65,41.75
N$73
  Top 0.254: IC7.26 88.52,53.25 86.36,55.4 86.23,55.09 R44.2
N$74
  Top 0.279: IC7.12 94.36,44.86 95.25,43.97
  Top 0.406: 95.25,43.97 J16.2 96.52,42.67 R35.1
N$75
  Top 0.254: J17.2 98.77,42.67
  Top 0.279: IC7.13 95.02,45.16 96.68,43.5
  Top 0.61: 98.77,42.67 97.95,43.5 96.68,43.5 | J17.2 100.33,42.67 R36.1
N$76
  Top 0.279: IC7.16 95.02,54.22 97.16,56.36 97.16,57.78 98.3,58.93 R45.2
REG_5V  (via drill 0.4)
  Top 0.406: L1.P$2 v17.78,28.89 | v22.23,33.34 22.23,34.29 24.77,36.83 24.77,43.81 25.08,44.13 R10.1 | 14.61,22.09 C2.1 14.68,22.17
  Top 0.508: D1.A 12.14,14.36
  Top 0.61: C2.1 14.73,22.99 15.88,24.13 15.88,25.4 17.48,25.4 L1.P$2 | 12.14,14.36 14.68,16.91 14.68,22.17
  Bottom 0.406: v17.78,28.89 v22.23,33.34
RXD  (via drill 0.4)
  Top 0.254: IC5.20 51.84,18.82 50.64,17.62 50.64,16.99 50.16,16.51
  Top 0.406: v42.55,13.34 46.99,13.34 50.16,16.51
  Bottom 0.406: v42.55,13.34 40.01,15.88 40.01,22.86 39.37,23.5 39.37,27.94 40.64,29.21 40.64,33.66 38.73,35.56 21.59,35.56 19.05,33.02 11.43,33.02 10.16,31.75 10.16,6.99 J4.3
RXLED  (via drill 0.4)
  Top 0.254: IC5.8 55.52,28.21 55.88,28.57 55.88,29.21
  Top 0.279: LED2.C 26.48,2.41
  Top 0.406: 26.48,2.41 v25.48,3.41 23.89,3.41 23.5,3.81 v20.32,3.81 | v73.66,31.11 v69.22,31.11 | v57.78,31.11 55.88,29.21
  Bottom 0.406: v31.11,31.75 25.4,31.75 20.32,26.67 v20.32,3.81 | v25.48,3.41 26.35,2.54 27.94,2.54 29.84,4.45 66.04,4.45 70.48,8.89 70.48,17.14 73.66,20.32 v73.66,31.11 | v69.22,31.11 v57.78,31.11
SCK  (via drill 0.4)
  Top 0.254: IC5.9 55.02,28.8 v53.34,30.48
  Top 0.406: 5.71,35.56 3.81,33.66 2.54,33.66 1.91,33.02 IC1.9 | IC1.5 5.71,35.56 | 5.71,35.56 v6.99,34.29 | v50.8,33.02 v42.55,41.27
  Bottom 0.406: J3.3 2.7,18.26 2.7,24.29 6.99,28.57 v6.99,34.29 17.78,34.29 20.95,37.47 38.73,37.47 v42.55,41.27 | v53.34,30.48 v50.8,33.02
SCK_3.3V
  Top 0.406: J6.5 4.77,50.01 4.29,49.53 4.29,43.02 6.99,40.32 IC1.4
SERVO  (via drill 0.4)
  Top 0.254: IC5.26 55.52,14.64 53.98,13.1
  Top 0.406: v67.94,8.26 52.7,8.26 51.44,9.53 51.44,11.43 53.1,13.1 53.98,13.1
  Bottom 0.406: 97.79,63.5 105.41,55.88 105.41,34.92 103.5,33.02 73.03,33.02 71.75,31.75 71.75,20.32 69.22,17.78 69.22,9.53 v67.94,8.26
  Bottom 0.61: J1.3 80.01,70.48 95.89,70.48 97.79,68.58 97.79,63.5
TOUCH1
  Top 0.254: 65.41,18.41 65,18.82 IC5.36
  Top 0.305: J11.Y1 98.31,9.41 97.79,8.89 97.79,8.26 J10.1
  Top 0.406: J10.1 90.17,12.06 71.75,12.06 65.41,18.41
TOUCH2
  Top 0.254: IC5.37 65.77,19.32 66.04,19.05
  Top 0.305: J11.X2 96.91,9.91 J10.2
  Top 0.406: J10.2 92.08,12.7 72.39,12.7 66.04,19.05
TOUCH3
  Top 0.254: 66.67,19.68 66.54,19.82 IC5.38
  Top 0.305: J11.Y2 96.91,10.41 J10.3
  Top 0.406: 66.67,19.68 73.03,13.34 93.98,13.34 J10.3
TOUCH4
  Top 0.254: IC5.39 67.31,20.32
  Top 0.305: J11.X1 98.31,10.91 97.79,11.43 97.79,12.06 J10.4
  Top 0.406: J10.4 73.66,13.97 67.31,20.32
TXD  (via drill 0.4)
  Top 0.254: IC5.21 52.45,18.32 51.44,17.3 51.44,16.51
  Top 0.406: 51.44,16.51 46.99,12.06 41.91,12.06 38.1,15.88 v38.1,34.29
  Bottom 0.406: v38.1,34.29 21.59,34.29 19.68,32.38 12.06,32.38 11.43,31.75 11.43,5.71 J4.4
TXLED  (via drill 0.4)
  Top 0.254: IC5.22 53.12,16.84 53.1,16.91
  Top 0.406: LED1.C 28.38,2.41 27.62,3.17 v27.62,4.76 | v33.02,9.53 49.53,9.53 50.16,10.16 50.16,13.97 53.1,16.91
  Bottom 0.406: v27.62,4.76 28.26,4.76 v33.02,9.53
VDD
  Top 0.406: J6.4 8.88,48.91 10.79,46.99 IC1.1 10.79,33.66 12.06,32.38 12.06,29.84 11.16,28.95 C6.1 10.95,25.19 10.95,24.92 10.34,24.31 IC3.2
X_DIR
  Top 0.254: IC5.12 52.74,22.82 52.07,23.5
  Top 0.279: IC6.3 65.66,45.81 63.34,43.5 | 59.37,41.27 55.4,41.27
  Top 0.406: 63.34,43.5 61.59,43.5 59.37,41.27 54.61,41.27 53.34,42.55 50.8,42.55 48.9,40.64 48.9,38.1 52.07,34.92 52.07,23.5
X_HOME  (via drill 0.4)
  Top 0.254: IC5.41 63.87,21.32 65.41,22.86
  Top 0.305: 65.41,22.86 66.04,23.5 66.67,23.5 v67.94,22.23 | 34.29,7.3 R6.2 34.42,7.11 34.42,7.18 34.29,7.3 | 34.29,7.3 v34.29,8.26
  Top 0.406: R17.1 55.67,65.28 v55.88,65.41 | v54.21,34.29 64.37,34.29 65.41,33.26 65.41,31.75 67.94,29.21 v67.94,22.23 | v51.12,37.7 51.12,40.32 v52.07,41.27
  Top 0.61: R17.1 44.58,65.28 J9.2
  Bottom 0.254: 56.52,61.59 56.52,57.15
  Bottom 0.406: v67.94,22.23 66.04,20.32 66.04,7.94 63.82,5.71 36.83,5.71 v34.29,8.26 | v55.88,65.41 55.88,62.23 56.52,61.59 | 56.52,57.15 57.78,55.88 57.78,48.26 55.88,46.35 52.7,46.35 52.07,45.72 v52.07,41.27 | v54.21,34.29 53.34,34.29 51.44,36.2 51.44,36.51 51.12,36.83 v51.12,37.7
X_STEP  (via drill 0.4)
  Top 0.254: IC5.30 57.52,14.88 v58.42,13.97
  Top 0.279: IC6.19 70.2,56.23 v71.12,57.15
  Top 0.305: 31.11,63.5 28.57,60.96 28.57,57.15
  Top 0.406: v66.04,61.59 65.25,61.59 64.77,62.07 v63.5,62.07 | 31.11,63.5 35.08,63.5 36.99,61.59 43.81,61.59 45.09,62.87 56.52,62.87 57.78,61.59 v59.69,61.59 | v34.29,14.61 34.29,33.02 31.75,35.56 31.75,40.01 30.72,41.12 30.72,49.45 28.57,51.59 28.57,57.15 | v69.22,25.4 69.22,22.86 70.48,21.59 v74.93,21.59
  Bottom 0.406: v63.5,62.07 62.71,62.07 62.23,61.59 v59.69,61.59 | v71.12,57.15 71.12,58.1 67.63,61.59 v66.04,61.59 | v58.42,13.97 59.69,13.97 62.23,16.51 62.23,24.13 63.5,25.4 v69.22,25.4 | v34.29,14.61 29.21,9.53 24.13,9.53 22.86,8.26 22.86,6.99 21.59,5.71 21.59,3.17 23.5,1.27 28.57,1.27 30.48,3.17 66.67,3.17 71.75,8.26 71.75,16.51 74.93,19.68 v74.93,21.59
Y_DIR  (via drill 0.4)
  Top 0.254: 84.14,39.69 v83.19,38.73 | IC5.29 57.02,14.11 58.42,12.7
  Top 0.279: IC7.3 88.52,44.7 87,43.18 84.77,43.18 84.14,42.55 84.14,39.69
  Top 0.406: 58.42,12.7 58.42,10.79 59.69,9.53 66.67,9.53 v67.94,10.79
  Bottom 0.406: v54.61,45.09 54.61,39.93 55.48,39.05 56.52,39.05 57.47,40.01 67.94,40.01 69.22,38.73 v83.19,38.73 80.01,35.56 71.75,35.56 70.48,34.29 70.48,21.59 67.94,19.05 v67.94,10.79
Y_HOME  (via drill 0.4)
  Top 0.254: IC5.40 64.95,20.82 v66.36,22.23
  Top 0.305: 36.32,7.11 R5.2 v36.2,8.26
  Top 0.406: v36.2,12.06 29.21,12.06 27.94,13.34 27.94,40.01 27.3,40.64 27.3,43.18 26.04,44.45 26.04,48.26 v26.67,48.9
  Top 0.61: J9.4 38.73,66.04 39.05,65.72 40.51,64.26 R18.1
  Bottom 0.305: v36.2,8.26 37.47,6.99 62.87,6.99
  Bottom 0.406: v26.67,48.9 23.5,52.07 19.68,52.07 19.05,52.7 19.05,60.96 24.77,66.67 27.3,66.67 28.57,65.41 29.84,65.41 31.11,64.14 | v66.36,22.23 64.77,20.64 64.77,8.89 62.87,6.99 | v36.2,12.06 v36.2,8.26
  Bottom 0.61: 31.11,64.14 33.02,64.14 J9.4
Y_STEP  (via drill 0.4)
  Top 0.254: IC5.28 56.52,13.34
  Top 0.279: IC7.19 93.06,55.28 93.98,56.2 93.98,59.05 93.34,59.69 v92.08,59.69
  Top 0.406: v71.12,62.87 v68.58,62.87 | v34.61,62.23 v31.11,62.23 | v40.01,12.06 36.83,15.24 36.83,42.55 41.27,46.99 41.27,48.9 40.01,50.16 v33.02,50.16 | v57.15,10.79 57.15,12.7 56.52,13.34 | v43.18,62.87 44.45,64.14 57.15,64.14 v58.42,62.87 | v62.23,62.87 62.87,63.5 65.41,63.5 v66.04,62.87
  Top 0.61: v88.9,62.87 v86.36,62.87
  Bottom 0.305: v31.11,62.23 31.11,57.15 33.02,55.24
  Bottom 0.406: v92.08,59.69 90.81,59.69 88.9,61.59 v88.9,62.87 | v86.36,62.87 v71.12,62.87 | v68.58,62.87 v66.04,62.87 | v34.61,62.23 41.75,62.23 42.39,62.87 v43.18,62.87 | v58.42,62.87 v62.23,62.87 | 33.02,55.24 v33.02,50.16 | v40.01,12.06 53.34,12.06 54.61,10.79 v57.15,10.79
Z_DIR  (via drill 0.4)
  Top 0.254: IC5.31 58.02,15.64 59.05,14.61
  Top 0.406: v59.69,12.7 59.69,13.97 59.05,14.61
  Bottom 0.254: 43.81,57.15 43.81,60.64 44.77,61.59 45.72,61.59
  Bottom 0.406: v59.69,12.7 53.98,12.7 50.8,15.88 46.35,15.88 43.81,18.41 43.81,30.48 43.18,31.11 43.18,32.38 43.81,33.02 43.81,41.91 42.55,43.18 42.55,55.88 43.81,57.15
  Bottom 0.61: 45.72,61.59 J2.4
Z_HOME  (via drill 0.4)
  Top 0.254: IC5.1 59.28,23.72 60.96,25.4 61.59,25.4
  Top 0.406: R19.1 37.34,62.99 | 61.59,25.4 v63.5,23.5 | v38.1,8.26 R4.2 | v27.94,45.09 27.94,43.81 28.57,43.18 28.57,32.38 29.21,31.75 29.21,15.88 31.75,13.34 v34.61,13.34
  Top 0.61: 37.34,62.99 35.56,64.77 33.02,64.77 31.75,66.04 J9.6
  Bottom 0.305: v38.1,8.26 61.59,8.26
  Bottom 0.406: v27.94,45.09 25.4,45.09 24.45,46.04 24.45,49.45 22.62,51.28 18.57,51.28 17.78,52.07 17.78,55.88 | 17.78,61.75 17.78,61.91 23.81,67.94 | v63.5,23.5 63.5,10.16 61.59,8.26 | v38.1,8.26 38.1,10.48 37.15,11.43 37.15,12.62 36.43,13.34 v34.61,13.34
  Bottom 0.61: J9.6 23.97,67.94 17.78,61.75 17.78,55.88
Z_STEP  (via drill 0.4)
  Top 0.254: IC5.32 58.52,15.86 59.13,15.24 60.33,15.24 60.96,14.61
  Top 0.406: 60.96,14.61 60.96,11.43 v60.33,10.79 | v34.29,45.09 35.56,43.81 35.56,14.61 v38.1,12.06
  Bottom 0.254: 41.27,60.96 41.27,57.15 41.27,55.24
  Bottom 0.406: 43.81,61.59 41.91,61.59 41.27,60.96 | v38.1,12.06 40.64,9.53 59.05,9.53 v60.33,10.79 | v34.29,45.09 39.37,45.09 41.27,46.99 41.27,57.15
  Bottom 0.61: 43.81,61.59 45.09,62.87 45.09,63.5 J2.5

### Text on the board
tPlace: Z | Y | X | STP | DIR | 5V | GND | 12V | XA1 | XA2 | XB1 | XB2 | PWM | +5V | GND | YA1 | YA2 | YB1 | YB2 | 1 | 1 | Current Limit | Current Limit | 1 | 1 | +5V | LCD Contrast | HWB | GND | RESET | RXD | TXD
tNames: J5 | + | + | 1 | 1 | 1 | + | L1 | IC5